# Altium project Multi_Interface_Hub_Pro_v1.0.PrjPcb (part 2 of 3)

## Sheet TypeA_3.1_Ports.SchDoc
size A3; SheetNumber: 1; SheetTotal: 4
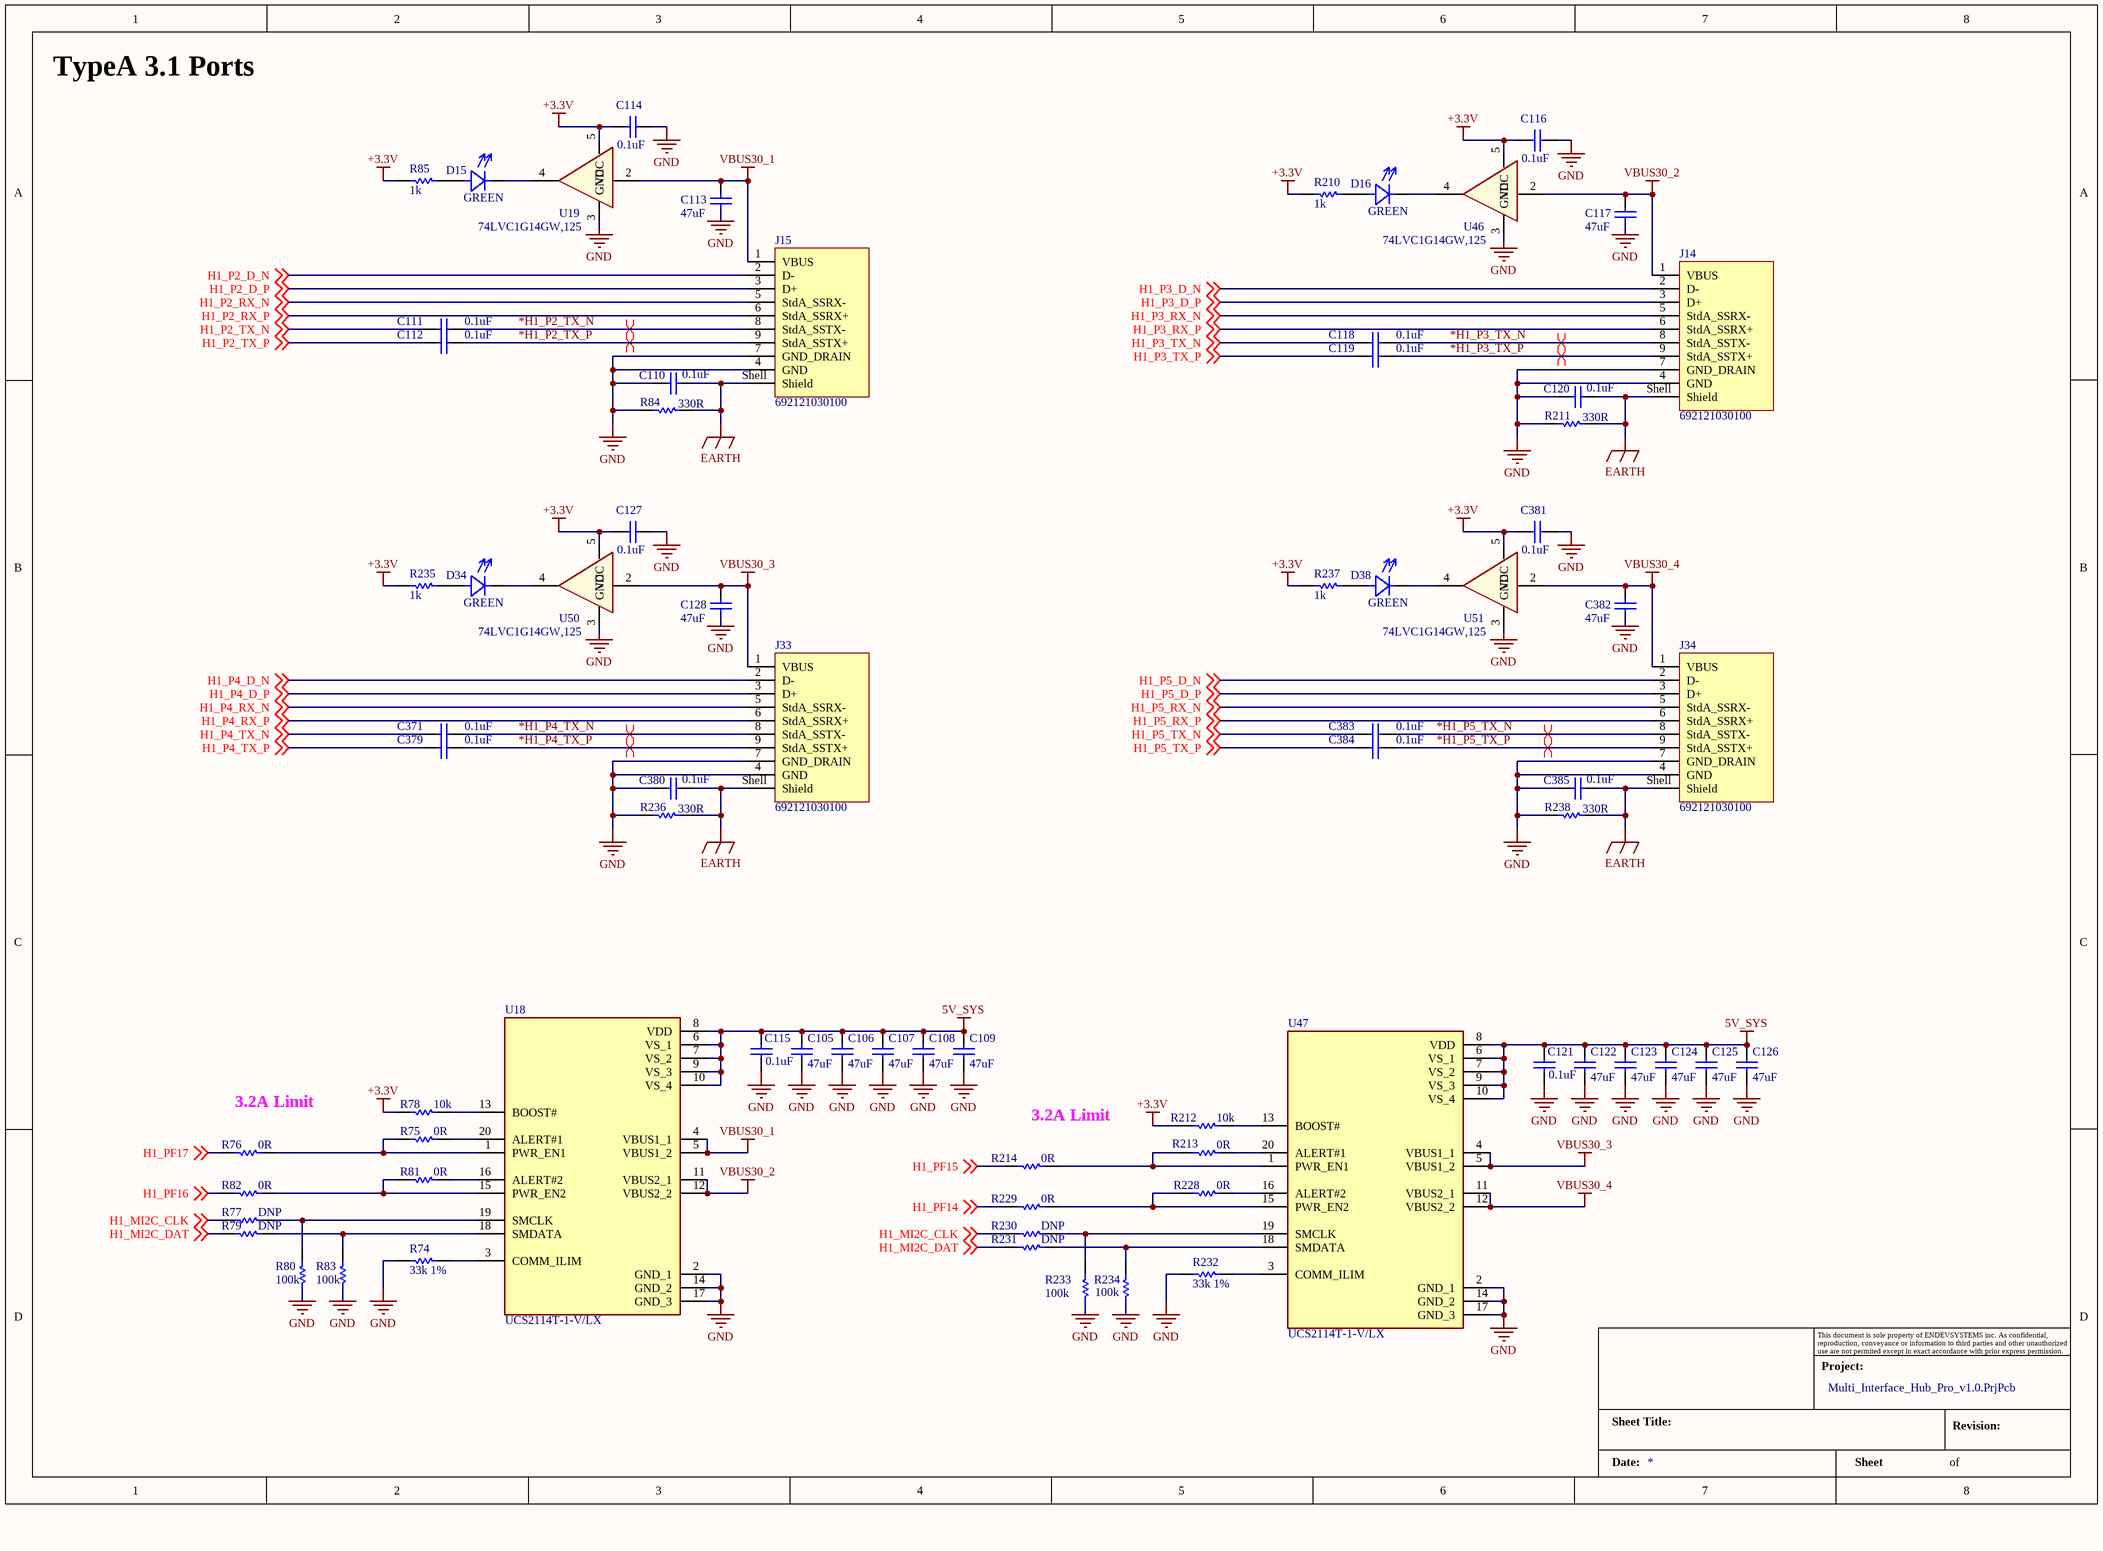
[diagram p5: TypeA_3.1_Ports.SchDoc]

### Parts
(Parts that share a designator on the sheet are numbered #1, #2 ... from top to bottom, then left to right.)
?#6  Project:: Multi_Interface_Hub_Pro_v1.0.PrjPcb  (hidden comment: Title_Block)  (graphical)
C105  value 47uF  [C-0402/1005]  (hidden comment: 0.1uF)
C106  value 47uF  [C-0402/1005]  (hidden comment: 0.1uF)
C107  value 47uF  [C-0402/1005]  (hidden comment: 0.1uF)
C108  value 47uF  [C-0402/1005]  (hidden comment: 0.1uF)
C109  value 47uF  [C-0402/1005]  (hidden comment: 0.1uF)
C110  0.1uF  [C-0603/1608]
C111  0.1uF  [C-0402/1005]
C112  0.1uF  [C-0402/1005]
C113  47uF  [C-0805/2012]
C114  0.1uF  [C-0402/1005]
C115  0.1uF  [C-0402/1005]
C116  0.1uF  [C-0402/1005]
C117  47uF  [C-0805/2012]
C118  0.1uF  [C-0402/1005]
C119  0.1uF  [C-0402/1005]
C120  0.1uF  [C-0603/1608]
C121  0.1uF  [C-0402/1005]
C122  value 47uF  [C-0402/1005]  (hidden comment: 0.1uF)
C123  value 47uF  [C-0402/1005]  (hidden comment: 0.1uF)
C124  value 47uF  [C-0402/1005]  (hidden comment: 0.1uF)
C125  value 47uF  [C-0402/1005]  (hidden comment: 0.1uF)
C126  value 47uF  [C-0402/1005]  (hidden comment: 0.1uF)
C127  0.1uF  [C-0402/1005]
C128  47uF  [C-0805/2012]
C371  0.1uF  [C-0402/1005]
C379  0.1uF  [C-0402/1005]
C380  0.1uF  [C-0603/1608]
C381  0.1uF  [C-0402/1005]
C382  47uF  [C-0805/2012]
C383  0.1uF  [C-0402/1005]
C384  0.1uF  [C-0402/1005]
C385  0.1uF  [C-0603/1608]
D15  GREEN  [LEDC1608X65N]
D16  GREEN  [LEDC1608X65N]
D34  GREEN  [LEDC1608X65N]
D38  GREEN  [LEDC1608X65N]
J14  692121030100  [692121030100]
J15  692121030100  [692121030100]
J33  692121030100  [692121030100]
J34  692121030100  [692121030100]
R74  33k 1%  [R-0402/1005]
R75  0R  [R-0402/1005]
R76  0R  [R-0402/1005]
R77  DNP  [R-0402/1005]
R78  10k  [R-0402/1005]
R79  DNP  [R-0402/1005]
R80  100k  [R-0402/1005]
R81  0R  [R-0402/1005]
R82  0R  [R-0402/1005]
R83  100k  [R-0402/1005]
R84  330R  [R-0603/1608]
R85  1k  [R-0402/1005]
R210  1k  [R-0402/1005]
R211  330R  [R-0603/1608]
R212  10k  [R-0402/1005]
R213  0R  [R-0402/1005]
R214  0R  [R-0402/1005]
R228  0R  [R-0402/1005]
R229  0R  [R-0402/1005]
R230  DNP  [R-0402/1005]
R231  DNP  [R-0402/1005]
R232  33k 1%  [R-0402/1005]
R233  100k  [R-0402/1005]
R234  100k  [R-0402/1005]
R235  1k  [R-0402/1005]
R236  330R  [R-0603/1608]
R237  1k  [R-0402/1005]
R238  330R  [R-0603/1608]
U18  UCS2114T-1-V/LX  [QFN50P300X300X90-20N-D]
U19  74LVC1G14GW,125  [SOT65P212X110-5N]
U46  74LVC1G14GW,125  [SOT65P212X110-5N]
U47  UCS2114T-1-V/LX  [QFN50P300X300X90-20N-D]
U50  74LVC1G14GW,125  [SOT65P212X110-5N]
U51  74LVC1G14GW,125  [SOT65P212X110-5N]

### Nets
5V_SYS: C105.2 C106.2 C107.2 C108.2 C109.2 C115.2 C121.2 C122.2 C123.2 C124.2 C125.2 C126.2 U18.6(VS_1) U18.7(VS_2) U18.8(VDD) U18.9(VS_3) U18.10(VS_4) U47.6(VS_1) U47.7(VS_2) U47.8(VDD) U47.9(VS_3) U47.10(VS_4)
+3.3V: C114.2 C116.2 C127.2 C381.2 R78.1 R85.2 R210.2 R212.1 R235.2 R237.2 U19.5(VCC) U46.5(VCC) U50.5(VCC) U51.5(VCC)
EARTH: C110.1 C120.1 C380.1 C385.1 J14.Shell(Shield) J15.Shell(Shield) J33.Shell(Shield) J34.Shell(Shield) R84.1 R211.1 R236.1 R238.1
GND: C105.1 C106.1 C107.1 C108.1 C109.1 C110.2 C113.1 C114.1 C115.1 C116.1 C117.1 C120.2 C121.1 C122.1 C123.1 C124.1 C125.1 C126.1 C127.1 C128.1 C380.2 C381.1 C382.1 C385.2 J14.4(GND) J14.7(GND_DRAIN) J15.4(GND) J15.7(GND_DRAIN) J33.4(GND) J33.7(GND_DRAIN) J34.4(GND) J34.7(GND_DRAIN) R74.1 R80.1 R83.1 R84.2 R211.2 R232.1 R233.1 R234.1 R236.2 R238.2 U18.2(GND_1) U18.14(GND_2) U18.17(GND_3) U19.3(GND) U46.3(GND) U47.2(GND_1) U47.14(GND_2) U47.17(GND_3) U50.3(GND) U51.3(GND)
VBUS30_1: C113.2 J15.1(VBUS) U18.4(VBUS1_1) U18.5(VBUS1_2) U19.2(A)
VBUS30_2: C117.2 J14.1(VBUS) U18.11(VBUS2_1) U18.12(VBUS2_2) U46.2(A)
VBUS30_3: C128.2 J33.1(VBUS) U47.4(VBUS1_1) U47.5(VBUS1_2) U50.2(A)
VBUS30_4: C382.2 J34.1(VBUS) U47.11(VBUS2_1) U47.12(VBUS2_2) U51.2(A)
*H1_P2_TX_N: C111.1 J15.8(StdA_SSTX-)
*H1_P2_TX_P: C112.1 J15.9(StdA_SSTX+)
*H1_P3_TX_N: C118.1 J14.8(StdA_SSTX-)
*H1_P3_TX_P: C119.1 J14.9(StdA_SSTX+)
*H1_P4_TX_N: C371.1 J33.8(StdA_SSTX-)
*H1_P4_TX_P: C379.1 J33.9(StdA_SSTX+)
*H1_P5_TX_N: C383.1 J34.8(StdA_SSTX-)
*H1_P5_TX_P: C384.1 J34.9(StdA_SSTX+)
H1_MI2C_CLK: R77.1 R230.1 ; off-sheet H1_MI2C_CLK
H1_MI2C_DAT: R79.1 R231.1 ; off-sheet H1_MI2C_DAT
H1_P2_D_N: J15.2(D-) ; off-sheet H1_P2_D_N
H1_P2_D_P: J15.3(D+) ; off-sheet H1_P2_D_P
H1_P2_RX_N: J15.5(StdA_SSRX-) ; off-sheet H1_P2_RX_N
H1_P2_RX_P: J15.6(StdA_SSRX+) ; off-sheet H1_P2_RX_P
H1_P2_TX_N: C111.2 ; off-sheet H1_P2_TX_N
H1_P2_TX_P: C112.2 ; off-sheet H1_P2_TX_P
H1_P3_D_N: J14.2(D-) ; off-sheet H1_P3_D_N
H1_P3_D_P: J14.3(D+) ; off-sheet H1_P3_D_P
H1_P3_RX_N: J14.5(StdA_SSRX-) ; off-sheet H1_P3_RX_N
H1_P3_RX_P: J14.6(StdA_SSRX+) ; off-sheet H1_P3_RX_P
H1_P3_TX_N: C118.2 ; off-sheet H1_P3_TX_N
H1_P3_TX_P: C119.2 ; off-sheet H1_P3_TX_P
H1_P4_D_N: J33.2(D-) ; off-sheet H1_P4_D_N
H1_P4_D_P: J33.3(D+) ; off-sheet H1_P4_D_P
H1_P4_RX_N: J33.5(StdA_SSRX-) ; off-sheet H1_P4_RX_N
H1_P4_RX_P: J33.6(StdA_SSRX+) ; off-sheet H1_P4_RX_P
H1_P4_TX_N: C371.2 ; off-sheet H1_P4_TX_N
H1_P4_TX_P: C379.2 ; off-sheet H1_P4_TX_P
H1_P5_D_N: J34.2(D-) ; off-sheet H1_P5_D_N
H1_P5_D_P: J34.3(D+) ; off-sheet H1_P5_D_P
H1_P5_RX_N: J34.5(StdA_SSRX-) ; off-sheet H1_P5_RX_N
H1_P5_RX_P: J34.6(StdA_SSRX+) ; off-sheet H1_P5_RX_P
H1_P5_TX_N: C383.2 ; off-sheet H1_P5_TX_N
H1_P5_TX_P: C384.2 ; off-sheet H1_P5_TX_P
H1_PF14: R229.1 ; off-sheet H1_PF14
H1_PF15: R214.1 ; off-sheet H1_PF15
H1_PF16: R82.1 ; off-sheet H1_PF16
H1_PF17: R76.1 ; off-sheet H1_PF17
NetD15_A: D15.A R85.1
NetD15_C: D15.C U19.4(~{Y})
NetD16_A: D16.A R210.1
NetD16_C: D16.C U46.4(~{Y})
NetD34_A: D34.A R235.1
NetD34_C: D34.C U50.4(~{Y})
NetD38_A: D38.A R237.1
NetD38_C: D38.C U51.4(~{Y})
NetR74_2: R74.2 U18.3(COMM_ILIM)
NetR75_1: R75.1 R76.2 U18.1(PWR_EN1)
NetR75_2: R75.2 U18.20(ALERT#1)
NetR77_2: R77.2 R80.2 U18.19(SMCLK)
NetR78_2: R78.2 U18.13(BOOST#)
NetR79_2: R79.2 R83.2 U18.18(SMDATA)
NetR81_1: R81.1 R82.2 U18.15(PWR_EN2)
NetR81_2: R81.2 U18.16(ALERT#2)
NetR212_2: R212.2 U47.13(BOOST#)
NetR213_1: R213.1 R214.2 U47.1(PWR_EN1)
NetR213_2: R213.2 U47.20(ALERT#1)
NetR228_1: R228.1 R229.2 U47.15(PWR_EN2)
NetR228_2: R228.2 U47.16(ALERT#2)
NetR230_2: R230.2 R233.2 U47.19(SMCLK)
NetR231_2: R231.2 R234.2 U47.18(SMDATA)
NetR232_2: R232.2 U47.3(COMM_ILIM)

### Layout directives
differential pair; differential pair class Diff_90R: *H1_P2_TX_N, *H1_P2_TX_P, *H1_P3_TX_N, *H1_P3_TX_P, *H1_P4_TX_N, *H1_P4_TX_P, *H1_P5_TX_N, *H1_P5_TX_P

### Notes on the sheet
- TypeA 3.1 Ports
- (near R76) 3.2A Limit
- (near R214) 3.2A Limit
- (in symbol Title_Block) This document is sole property of ENDEVSYSTEMS inc. As confidential, reproduction, conveyance or information to third parties and other unauthorized use are not permited except in exact accordance with prior express permission.; Project:; Sheet Title:; Revision:; Date:; Sheet; of

### Library data of the parts
C105-C112 C114-C116 C118-C127 C371 C379-C381 C383-C385 = Cap: Capacitor; Published: 8-Jun-2000; LatestRevisionDate: 17-Jul-2002; LatestRevisionNote: Re-released for DXP Platform.; PackageReference: RAD-0.3; Publisher: Altium Limited; PackageDescription: Radial Cap, Thru-Hole; 2 Leads; 0.3 in Pin Spacing
  C110-C112 C114-C116 C118-C121 C127 C371 C379-C381 C383-C385: Value: 0.1uF
C113 C117 C128 C382 = Cap: Capacitor; Value: 0.1uF; Published: 8-Jun-2000; LatestRevisionDate: 17-Jul-2002; LatestRevisionNote: Re-released for DXP Platform.; PackageReference: RAD-0.3; Publisher: Altium Limited; PackageDescription: Radial Cap, Thru-Hole; 2 Leads; 0.3 in Pin Spacing
D15 D16 D34 D38 = Diode-LED: Supplier: Digikey Electronics
J14 J15 J33 J34 = CMP-1502-03216-3: NexarPartId: 19667814; Voltage Rating: 30V; Current Rating: 1.8A; Contact Resistance: 50mΩ; Number of Ports: 1; Connector Type: USB; Gender: Receptacle; USB Standard: USB 3.0; Insulation Resistance: 100MΩ; Number of Contacts: 9; RoHS: Compliant; Voltage Rating (AC): 30V; Min Operating Temperature: -20°C; Contact Material: Bronze, Gold, Nickel; Features: Shielded; Color: Blue; Termination: Through Hole; Mount: Horizontal, Through Hole; Length: 15.48mm; Max Operating Temperature: 85°C; Packaging: Tape and Reel; Flammability Rating: UL94 V-0; Lead Free: Lead Free; REACH SVHC: Unknown; Number of Pins: 9; Contact Plating: Gold; Width: 16.48mm; Height: 7.87mm; Operating Supply Voltage: 30V; Orientation: Horizontal
R74-R77 R79-R85 R210 R211 R213 R214 R228-R238 = Res1: Resistor; Value: 10K; Published: 8-Jun-2000; LatestRevisionDate: 17-Jul-2002; LatestRevisionNote: Re-released for DXP Platform.; PackageReference: AXIAL-0.3; Publisher: Altium Limited; PackageDescription: Axial Device, Thru-Hole; 2 Leads; 0.3 in Pin Spacing
R78 R212 = Res1: Resistor; Published: 8-Jun-2000; LatestRevisionDate: 17-Jul-2002; LatestRevisionNote: Re-released for DXP Platform.; PackageReference: AXIAL-0.3; Publisher: Altium Limited; PackageDescription: Axial Device, Thru-Hole; 2 Leads; 0.3 in Pin Spacing; Value: 10K
U18 U47 = UCS2114T-1-V_LX: Integrated Circuit; Manufacturer_Name: Microchip; Datasheet Link: https://www.mouser.in/datasheet/2/268/UCS2114_Data_Sheet_20005743B-2900672.pdf; Height: 0.9mm; Manufacturer_Part_Number: UCS2114T-1-V/LX; Mouser Part Number: 579-UCS2114T-1-V/LX; Mouser Price/Stock: https://www.mouser.co.uk/ProductDetail/Microchip-Technology/UCS2114T-1-V-LX?qs=Mv7BduZupUg9QQFwmxWMcA%3D%3D; Arrow Part Number: UCS2114T-1-V/LX; Arrow Price/Stock: https://www.arrow.com/en/products/ucs2114t-1-vlx/microchip-technology?region=nac
U19 U46 U50 U51 = 74LVC1G14GW,125: Inverter Schmitt Trigger 1-Element CMOS 5-Pin TSSOP T/R; Price: None; Availability: Unavailable; MP: 74LVC1G14GW,125; Value: *; Package: None
?#6 = Title_Block: Date:: *

## Sheet USBC_DS1_DS2.SchDoc
size A3; SheetNumber: 1; SheetTotal: 4; SPICEModelCacheQHYZYIJX: <root> / <DocumentId>QHYZYIJX</DocumentId> / </root>
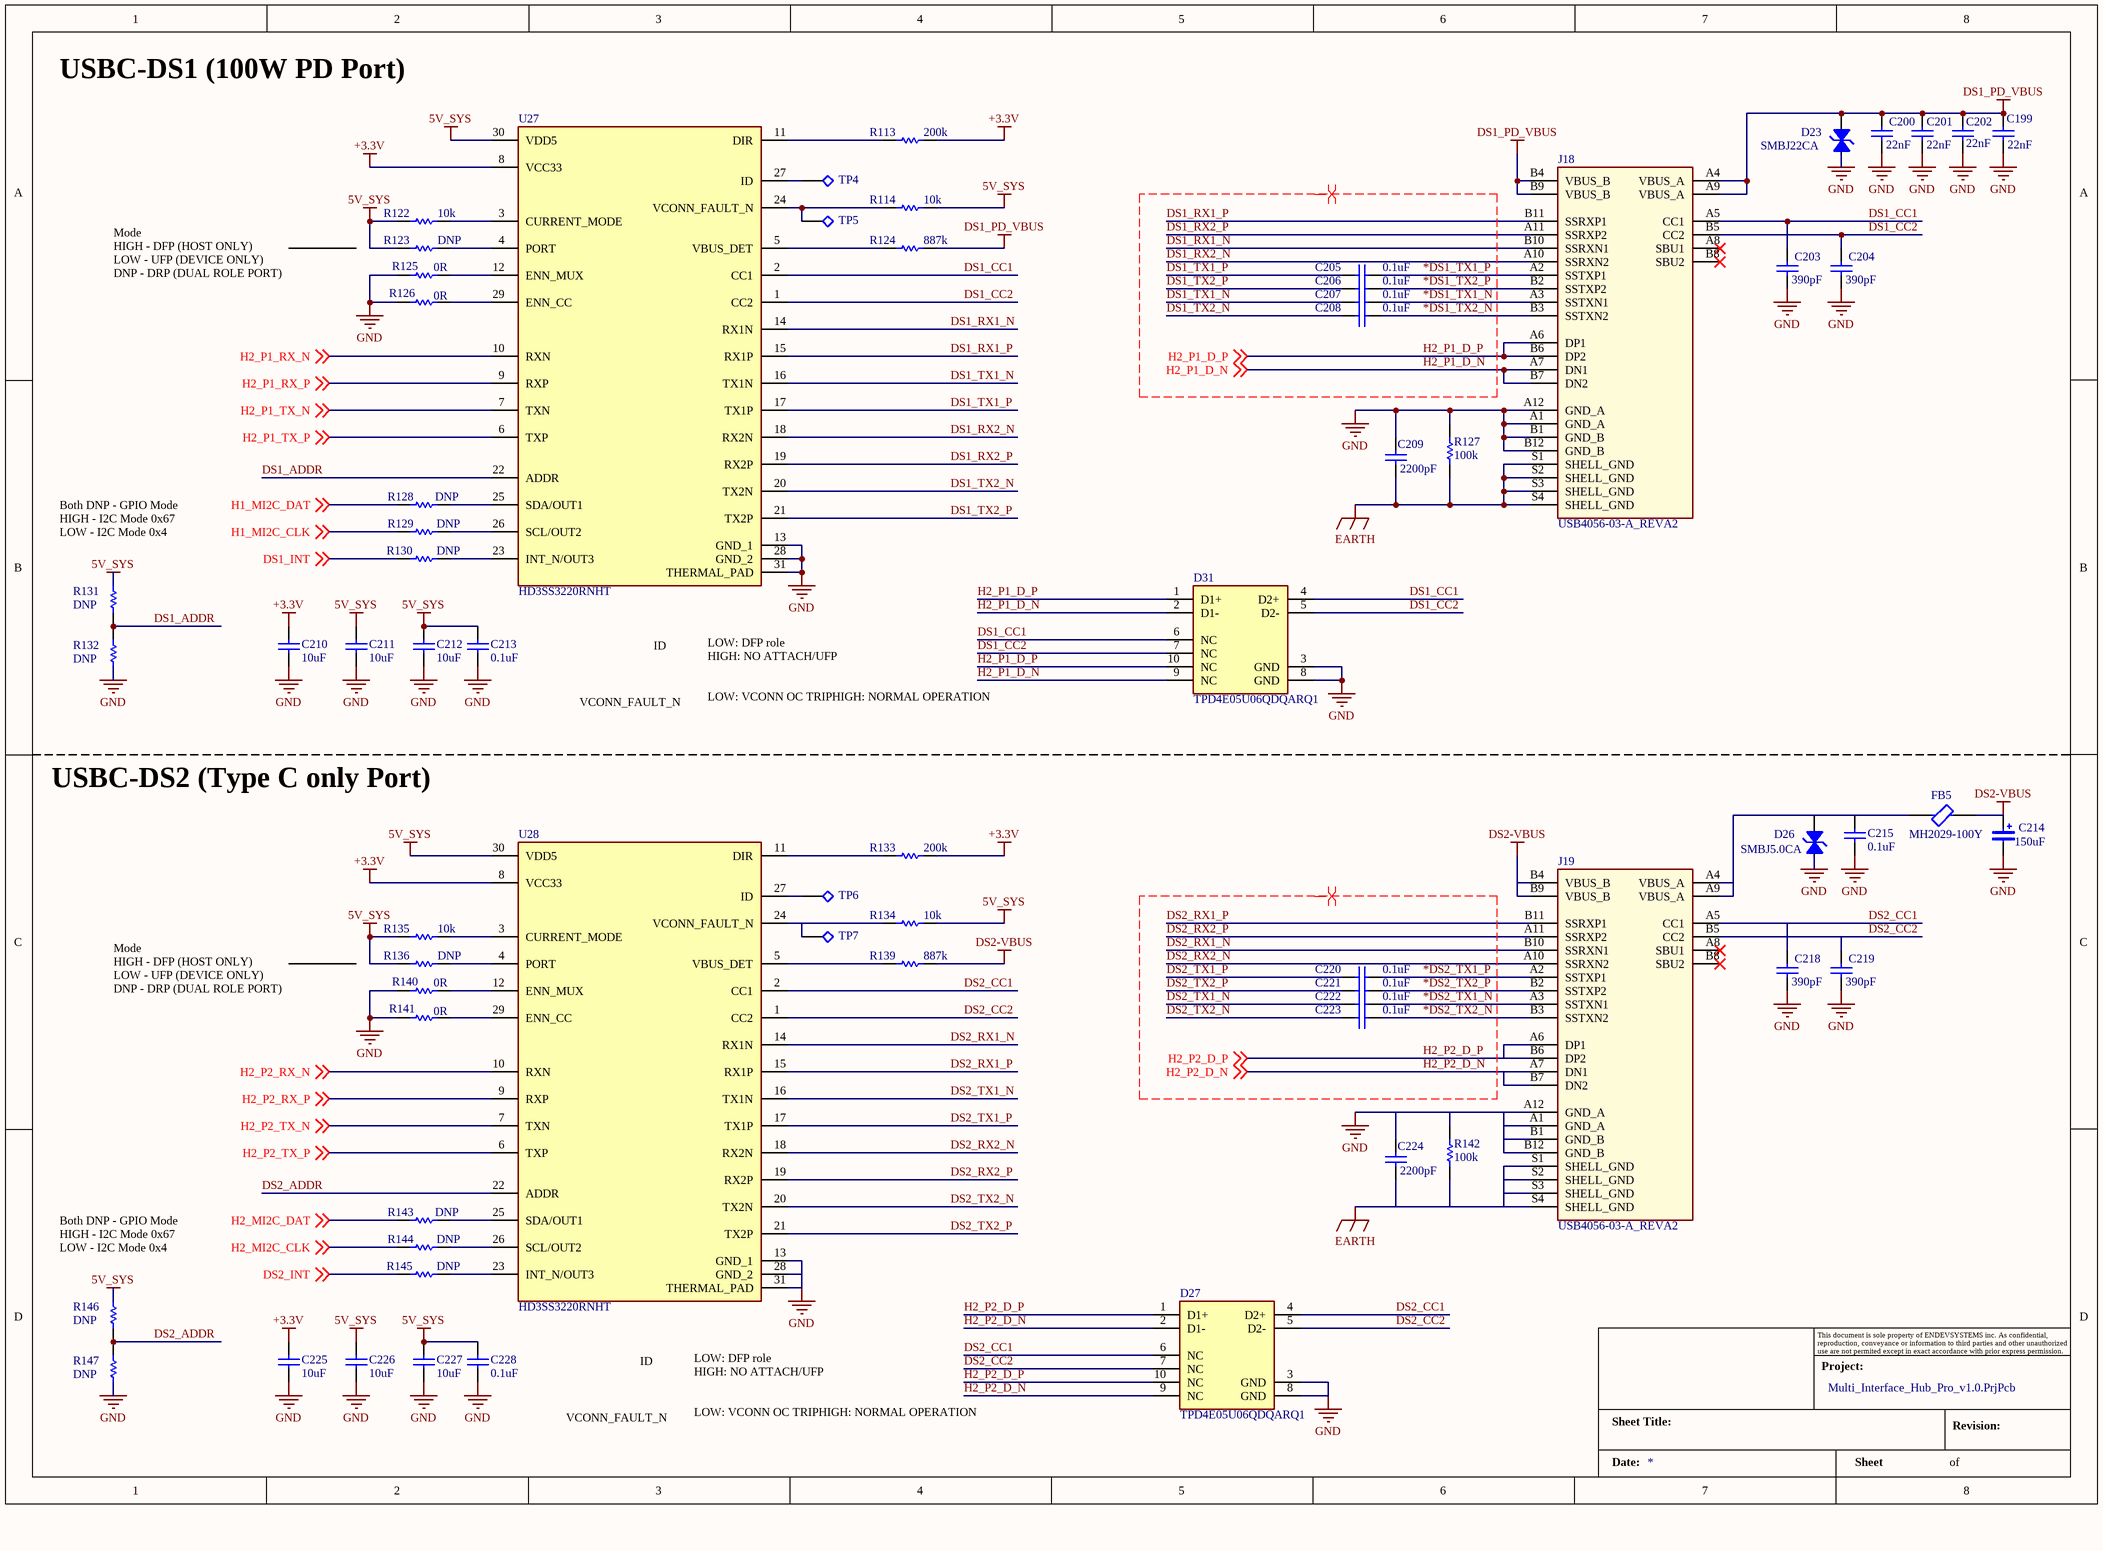
[diagram p6: USBC_DS1_DS2.SchDoc]

### Parts
(Parts that share a designator on the sheet are numbered #1, #2 ... from top to bottom, then left to right.)
?#7  Project:: Multi_Interface_Hub_Pro_v1.0.PrjPcb  (hidden comment: Title_Block)  (graphical)
C199  22nF  [C-0805/2012]
C200  22nF  [C-0805/2012]
C201  22nF  [C-0805/2012]
C202  22nF  [C-0805/2012]
C203  390pF  [C-0805/2012]
C204  390pF  [C-0805/2012]
C205  0.1uF  [CAP 1206/3216]
C206  0.1uF  [CAP 1206/3216]
C207  0.1uF  [CAP 1206/3216]
C208  0.1uF  [CAP 1206/3216]
C209  2200pF  [C-0603/1608]
C210  10uF  [CAP 1206/3216]
C211  10uF  [CAP 1206/3216]
C212  10uF  [CAP 1206/3216]
C213  0.1uF  [CAP 1206/3216]
C214  150uF  [CAP-TAN-2312]
C215  0.1uF  [CAP 1206/3216]
C218  390pF  [C-0805/2012]
C219  390pF  [C-0805/2012]
C220  0.1uF  [CAP 1206/3216]
C221  0.1uF  [CAP 1206/3216]
C222  0.1uF  [CAP 1206/3216]
C223  0.1uF  [CAP 1206/3216]
C224  2200pF  [C-0603/1608]
C225  10uF  [CAP 1206/3216]
C226  10uF  [CAP 1206/3216]
C227  10uF  [CAP 1206/3216]
C228  0.1uF  [CAP 1206/3216]
D23  SMBJ22CA  [DO-214AA\SMB]
D26  SMBJ5.0CA  [DO-214AA\SMB]
D27  TPD4E05U06QDQARQ1  [FP-DQA0010A-MFG]
D31  TPD4E05U06QDQARQ1  [FP-DQA0010A-MFG]
FB5  MH2029-100Y  [R-0805/2012]
J18  USB4056-03-A_REVA2  [GCT_USB4056-03-A_REVA2]
J19  USB4056-03-A_REVA2  [GCT_USB4056-03-A_REVA2]
R113  200k  [R-0402]
R114  10k  [R-0402]
R122  10k  [R-0402]
R123  DNP  [R-0402]
R124  887k  [R-0402]
R125  0R  [R-0402]
R126  0R  [R-0402]
R127  100k  [R-0603/1608]
R128  DNP  [R-0402]
R129  DNP  [R-0402]
R130  DNP  [R-0402]
R131  DNP  [R-0402]
R132  DNP  [R-0402]
R133  200k  [R-0402]
R134  10k  [R-0402]
R135  10k  [R-0402]
R136  DNP  [R-0402]
R139  887k  [R-0402]
R140  0R  [R-0402]
R141  0R  [R-0402]
R142  100k  [R-0603/1608]
R143  DNP  [R-0402]
R144  DNP  [R-0402]
R145  DNP  [R-0402]
R146  DNP  [R-0402]
R147  DNP  [R-0402]
TP4  Test Points  [Test Point TH Round H0.9,D1.6]  (value not drawn)
TP5  Test Points  [Test Point TH Round H0.9,D1.6]  (value not drawn)
TP6  Test Points  [Test Point TH Round H0.9,D1.6]  (value not drawn)
TP7  Test Points  [Test Point TH Round H0.9,D1.6]  (value not drawn)
U27  HD3SS3220RNHT  [QFN40P250X450X80-31N-D]
U28  HD3SS3220RNHT  [QFN40P250X450X80-31N-D]

### Nets
5V_SYS: C211.2 C212.2 C213.2 C226.2 C227.2 C228.2 R114.2 R122.1 R123.1 R131.2 R134.2 R135.1 R136.1 R146.2 U27.30(VDD5) U28.30(VDD5)
+3.3V: C210.2 C225.2 R113.2 R133.2 U27.8(VCC33) U28.8(VCC33)
DS1_PD_VBUS: C199.2 C200.2 C201.2 C202.2 D23.2 J18.A4(VBUS_A) J18.A9(VBUS_A) J18.B4(VBUS_B) J18.B9(VBUS_B) R124.1
DS2-VBUS: C214.+ FB5.2 J19.B4(VBUS_B) J19.B9(VBUS_B) R139.1
EARTH: C209.1 C224.1 J18.S1(SHELL_GND) J18.S2(SHELL_GND) J18.S3(SHELL_GND) J18.S4(SHELL_GND) J19.S1(SHELL_GND) J19.S2(SHELL_GND) J19.S3(SHELL_GND) J19.S4(SHELL_GND) R127.1 R142.1
GND: C199.1 C200.1 C201.1 C202.1 C203.1 C204.1 C209.2 C210.2 C211.2 C212.2 C213.2 C214.- C215.2 C218.1 C219.1 C224.2 C225.2 C226.2 C227.2 C228.2 D23.1 D26.1 D27.3(GND) D27.8(GND) D31.3(GND) D31.8(GND) J18.A1(GND_A) J18.A12(GND_A) J18.B1(GND_B) J18.B12(GND_B) J19.A1(GND_A) J19.A12(GND_A) J19.B1(GND_B) J19.B12(GND_B) R125.1 R126.1 R127.2 R132.1 R140.1 R141.1 R142.2 R147.1 U27.13(GND_1) U27.28(GND_2) U27.31(THERMAL_PAD) U28.13(GND_1) U28.28(GND_2) U28.31(THERMAL_PAD)
*DS1_TX1_N: C207.2 J18.A3(SSTXN1)
*DS1_TX1_P: C205.2 J18.A2(SSTXP1)
*DS1_TX2_N: C208.2 J18.B3(SSTXN2)
*DS1_TX2_P: C206.2 J18.B2(SSTXP2)
*DS2_TX1_N: C222.2 J19.A3(SSTXN1)
*DS2_TX1_P: C220.2 J19.A2(SSTXP1)
*DS2_TX2_N: C223.2 J19.B3(SSTXN2)
*DS2_TX2_P: C221.2 J19.B2(SSTXP2)
DS1_ADDR: R131.1 R132.2 U27.22(ADDR)
DS1_CC1: C203.2 D31.4(D2+) D31.6(NC) J18.A5(CC1) U27.2(CC1)
DS1_CC2: C204.2 D31.5(D2-) D31.7(NC) J18.B5(CC2) U27.1(CC2)
DS1_INT: R130.1 ; off-sheet DS1_INT
DS1_RX1_N: J18.B10(SSRXN1) U27.14(RX1N)
DS1_RX1_P: J18.B11(SSRXP1) U27.15(RX1P)
DS1_RX2_N: J18.A10(SSRXN2) U27.18(RX2N)
DS1_RX2_P: J18.A11(SSRXP2) U27.19(RX2P)
DS1_TX1_N: C207.2 U27.16(TX1N)
DS1_TX1_P: C205.2 U27.17(TX1P)
DS1_TX2_N: C208.2 U27.20(TX2N)
DS1_TX2_P: C206.2 U27.21(TX2P)
DS2_ADDR: R146.1 R147.2 U28.22(ADDR)
DS2_CC1: C218.2 D27.4(D2+) D27.6(NC) J19.A5(CC1) U28.2(CC1)
DS2_CC2: C219.2 D27.5(D2-) D27.7(NC) J19.B5(CC2) U28.1(CC2)
DS2_INT: R145.1 ; off-sheet DS2_INT
DS2_RX1_N: J19.B10(SSRXN1) U28.14(RX1N)
DS2_RX1_P: J19.B11(SSRXP1) U28.15(RX1P)
DS2_RX2_N: J19.A10(SSRXN2) U28.18(RX2N)
DS2_RX2_P: J19.A11(SSRXP2) U28.19(RX2P)
DS2_TX1_N: C222.2 U28.16(TX1N)
DS2_TX1_P: C220.2 U28.17(TX1P)
DS2_TX2_N: C223.2 U28.20(TX2N)
DS2_TX2_P: C221.2 U28.21(TX2P)
H1_MI2C_CLK: R129.1 ; off-sheet H1_MI2C_CLK
H1_MI2C_DAT: R128.1 ; off-sheet H1_MI2C_DAT
H2_MI2C_CLK: R144.1 ; off-sheet H2_MI2C_CLK
H2_MI2C_DAT: R143.1 ; off-sheet H2_MI2C_DAT
H2_P1_D_N: D31.2(D1-) D31.9(NC) J18.A7(DN1) J18.B7(DN2) ; off-sheet H2_P1_D_N
H2_P1_D_P: D31.1(D1+) D31.10(NC) J18.A6(DP1) J18.B6(DP2) ; off-sheet H2_P1_D_P
H2_P1_RX_N: U27.10(RXN) ; off-sheet H2_P1_RX_N
H2_P1_RX_P: U27.9(RXP) ; off-sheet H2_P1_RX_P
H2_P1_TX_N: U27.7(TXN) ; off-sheet H2_P1_TX_N
H2_P1_TX_P: U27.6(TXP) ; off-sheet H2_P1_TX_P
H2_P2_D_N: D27.2(D1-) D27.9(NC) J19.A7(DN1) J19.B7(DN2) ; off-sheet H2_P2_D_N
H2_P2_D_P: D27.1(D1+) D27.10(NC) J19.A6(DP1) J19.B6(DP2) ; off-sheet H2_P2_D_P
H2_P2_RX_N: U28.10(RXN) ; off-sheet H2_P2_RX_N
H2_P2_RX_P: U28.9(RXP) ; off-sheet H2_P2_RX_P
H2_P2_TX_N: U28.7(TXN) ; off-sheet H2_P2_TX_N
H2_P2_TX_P: U28.6(TXP) ; off-sheet H2_P2_TX_P
NetC215_2: C215.2 D26.2 FB5.1 J19.A4(VBUS_A) J19.A9(VBUS_A)
NetR113_1: R113.1 U27.11(DIR)
NetR114_1: R114.1 TP5.1 U27.24(VCONN_FAULT_N)
NetR122_2: R122.2 U27.3(CURRENT_MODE)
NetR123_2: R123.2 U27.4(PORT)
NetR124_2: R124.2 U27.5(VBUS_DET)
NetR125_2: R125.2 U27.12(ENN_MUX)
NetR126_2: R126.2 U27.29(ENN_CC)
NetR128_2: R128.2 U27.25(SDA/OUT1)
NetR129_2: R129.2 U27.26(SCL/OUT2)
NetR130_2: R130.2 U27.23(INT_N/OUT3)
NetR133_1: R133.1 U28.11(DIR)
NetR134_1: R134.1 TP7.1 U28.24(VCONN_FAULT_N)
NetR135_2: R135.2 U28.3(CURRENT_MODE)
NetR136_2: R136.2 U28.4(PORT)
NetR139_2: R139.2 U28.5(VBUS_DET)
NetR140_2: R140.2 U28.12(ENN_MUX)
NetR141_2: R141.2 U28.29(ENN_CC)
NetR143_2: R143.2 U28.25(SDA/OUT1)
NetR144_2: R144.2 U28.26(SCL/OUT2)
NetR145_2: R145.2 U28.23(INT_N/OUT3)
NetTP4_1: TP4.1 U27.27(ID)
NetTP6_1: TP6.1 U28.27(ID)

Not connected (* = marked no-connect by the designer): J18 A8(SBU1)* B8(SBU2)*; J19 A8(SBU1)* B8(SBU2)*

### Layout directives
differential pair; differential pair class Diff_90R: *DS1_TX1_N, *DS1_TX1_P, *DS1_TX2_N, *DS1_TX2_P, *DS2_TX1_N, *DS2_TX1_P, *DS2_TX2_N, *DS2_TX2_P, DS1_RX1_N, DS1_RX1_P, DS1_RX2_N, DS1_RX2_P, DS1_TX1_N, DS1_TX1_P, DS1_TX2_N, DS1_TX2_P, DS2_RX1_N, DS2_RX1_P, DS2_RX2_N, DS2_RX2_P, DS2_TX1_N, DS2_TX1_P, DS2_TX2_N, DS2_TX2_P, H2_P1_D_N, H2_P1_D_P, H2_P2_D_N, H2_P2_D_P

### Notes on the sheet
- USBC-DS1 (100W PD Port)
- Mode
  HIGH - DFP (HOST ONLY)
  LOW - UFP (DEVICE ONLY)
  DNP - DRP (DUAL ROLE PORT)
- (near R131) Both DNP - GPIO Mode
  HIGH - I2C Mode 0x67
  LOW - I2C Mode 0x4
- ID
- VCONN_FAULT_N
- LOW: DFP role
  HIGH: NO ATTACH/UFP
- LOW: VCONN OC TRIPHIGH: NORMAL OPERATION
- USBC-DS2 (Type C only Port)
- (near R146) Both DNP - GPIO Mode
  HIGH - I2C Mode 0x67
  LOW - I2C Mode 0x4
- (in symbol Title_Block) This document is sole property of ENDEVSYSTEMS inc. As confidential, reproduction, conveyance or information to third parties and other unauthorized use are not permited except in exact accordance with prior express permission.; Project:; Sheet Title:; Revision:; Date:; Sheet; of

### Library data of the parts
C199-C204 C209 C218 C219 C224 = Cap: Capacitor; Value: 0.1uF; Published: 8-Jun-2000; LatestRevisionDate: 17-Jul-2002; LatestRevisionNote: Re-released for DXP Platform.; PackageReference: RAD-0.3; Publisher: Altium Limited; PackageDescription: Radial Cap, Thru-Hole; 2 Leads; 0.3 in Pin Spacing
C205-C208 C210-C213 C215 C220-C223 C225-C228 = CAP 1206/3216: CAP CER 10UF 25V X5R 1206; Mfr. Part No.: C1206C106M3PACTU; Unit Price (USD): 0.28; Supplier Part No.: 399-8153-1-ND; Supplier: Digikey Electronics
C214 = Capacitor-Polar: CAP TANT 10UF 10% 16V 1206; Mfr. Part No.: F931C106KAAAJ6; Unit Price (USD): 0.67; Value: 10uF 16V; Supplier Part No.: 478-10723-1-ND; Supplier: Digikey Electronics
D23 D26 = ACPDQC3V3T-HF: TVS DIODE 3.3V 9.8V 0402C; Unit Price (USD): 0.41; Mfr. Part No.: ACPDQC3V3T-HF; Supplier Part No.: 641-1635-1-ND; Supplier: Digikey Electronics
D27 D31 = CMP-04985-000004-1: TVS DIODE 5.5V 14V 10USON; Manufacturer: Texas Instruments; Direction: Unidirectional; Standoff Height: 0mm; Description: 14V Clamp 2.5A (8/20µs) Ipp Tvs Diode Surface Mount 10-USON (2.5x1); Capacitance: 0.5pF; Number Of Channels: 4; Breakdown Voltage: 6.4V; Peak Pulse Power: 2.5W; Automotive Grade: Grade 1; Value: 0.5pF; Interface: USB,Ethernet,LVDS,Other; Peak Pulse Current: 2.5A; Operating Supply Voltage: 5.5V; Reverse Standoff Voltage: 5.5V; Package: DQA0010A; Temperature Range Low: -40°C; Temperature Range High: +125°C; Ambient Temperature Range Low: -40°C; Device Class L1: Circuit Protection; Clamping Voltage: 14V; Manufacturer Part Number: TPD4E05U06QDQARQ1; Device Class L2: ESD and Circuit Protection ICs; Octopart: https://octopart.com/tpd4e05u06qdqarq1-texas+instruments-48523459; Device Class L3: unset; Height: 0.55mm; Automotive: Yes; ComponentLink2Description: Datasheet; RoHS: TRUE; Ambient Temperature Range High: +125°C; Category: IC; Mouser Description: Automotive 4-Channel ESD Protection Solution for SuperSpeed (up to 5 Gbps) Interface 10-USON -40 to 125; Temperature: -40°C to +125°C; ComponentLink2URL: http://www.ti.com/lit/ds/symlink/tpd4e05u06-q1.pdf; Digikey Description: TVS DIODE 5.5V 14V 10USON; Lead Free: Yes
FB5 = 5f30dd21d616792df468990f7003faa: Chip Ferrite Bead Array, 1206, 50Ω @ 100MHz, 0.0016Ω, ±12.5Ω, 12A; Number of Lines: 1; DC Resistance (DCR): 1.6mR; Max Current Rating: 12A; Case Code (Metric): 3216; Package Quantity: 3000; Height: 0.051inch; RoHS Compliant: Yes; Case/Package: 1206; Mount: Surface Mount; Case Code (Imperial): 1206; Width: 0.063inch; Length: 0.126inch; Max Operating Temperature: 125°C; Ratings: AEC-Q200; Packaging: Tape and Reel; Min Operating Temperature: -55°C
J18 J19 = USB4056-03-A_REVA2: USB-C (USB TYPE-C) USB 3.2 Gen 2 (USB 3.1 Gen 2, Superspeed + (USB 3.1)) Receptacle Connector 24 Position Surface Mount, Right Angle; Through Hole; MF: Global Connector Technology; Package: None; Check_prices: https://www.snapeda.com/parts/USB4056-03-A/Global+Connector+Technology/view-part/?ref=eda; Value: *; Availability: In Stock; SnapEDA_Link: https://www.snapeda.com/parts/USB4056-03-A/Global+Connector+Technology/view-part/?ref=snap; MP: USB4056-03-A; Price: None
R113 R114 R122-R126 R128-R136 R139-R141 R143-R147 = Resistor: RES SMD 51 OHM 0.5% 1/16W 0402; Mfr. Part No.: ERA-2AED510X; Value: 51R; Unit Price (USD): 0.21; Supplier Part No.: P51DECT-ND; Supplier: Digikey Electronics
R127 R142 = Res1: Resistor; Value: 10K; Published: 8-Jun-2000; LatestRevisionDate: 17-Jul-2002; LatestRevisionNote: Re-released for DXP Platform.; PackageReference: AXIAL-0.3; Publisher: Altium Limited; PackageDescription: Axial Device, Thru-Hole; 2 Leads; 0.3 in Pin Spacing
U27 U28 = HD3SS3220RNHT: Integrated Circuit; Manufacturer_Name: Texas Instruments; Datasheet Link: http://www.ti.com/lit/gpn/HD3SS3220; Height: 0.8mm; Manufacturer_Part_Number: HD3SS3220RNHT; Mouser Part Number: 595-HD3SS3220RNHT; Mouser Price/Stock: https://www.mouser.co.uk/ProductDetail/Texas-Instruments/HD3SS3220RNHT?qs=8%2FmU9qzJpL9k3fo1z5Ctsg%3D%3D; Arrow Part Number: HD3SS3220RNHT; Arrow Price/Stock: https://www.arrow.com/en/products/hd3ss3220rnht/texas-instruments?region=nac
?#7 = Title_Block: Date:: *

## Sheet USBC_DS3_DS4.SchDoc
size A3; SheetNumber: 1; SheetTotal: 4
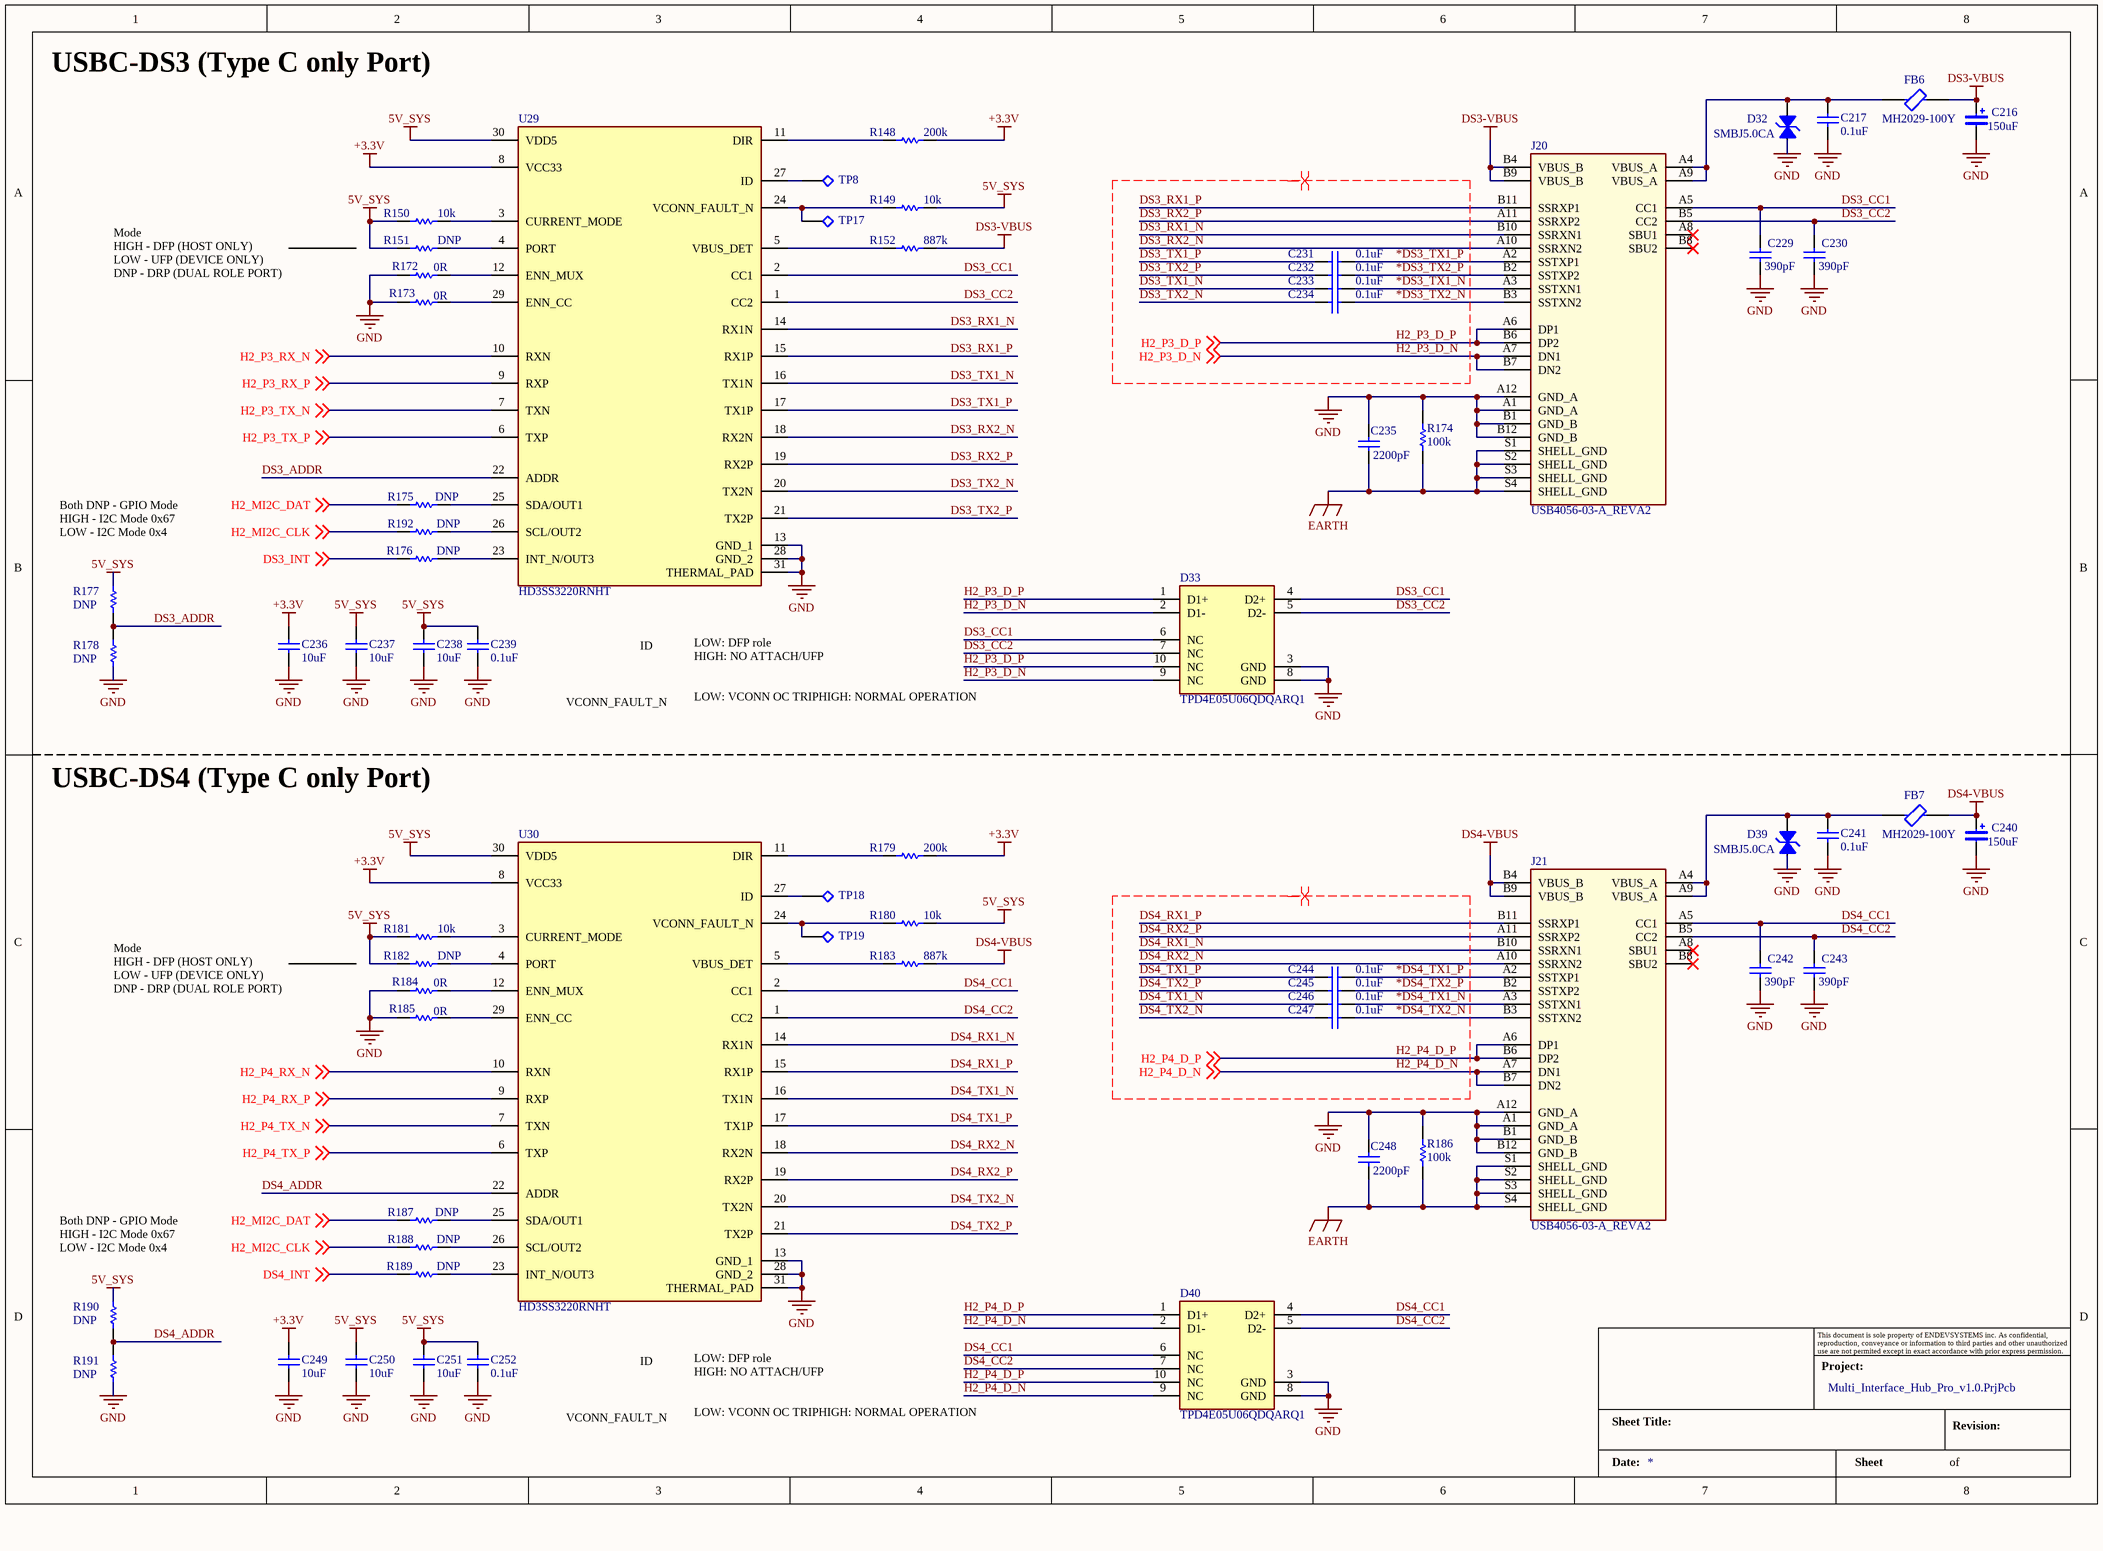
[diagram p7: USBC_DS3_DS4.SchDoc]

### Parts
(Parts that share a designator on the sheet are numbered #1, #2 ... from top to bottom, then left to right.)
?#8  Project:: Multi_Interface_Hub_Pro_v1.0.PrjPcb  (hidden comment: Title_Block)  (graphical)
C216  150uF  [CAP-TAN-2312]
C217  0.1uF  [CAP 1206/3216]
C229  390pF  [C-0805/2012]
C230  390pF  [C-0805/2012]
C231  0.1uF  [CAP 1206/3216]
C232  0.1uF  [CAP 1206/3216]
C233  0.1uF  [CAP 1206/3216]
C234  0.1uF  [CAP 1206/3216]
C235  2200pF  [C-0603/1608]
C236  10uF  [CAP 1206/3216]
C237  10uF  [CAP 1206/3216]
C238  10uF  [CAP 1206/3216]
C239  0.1uF  [CAP 1206/3216]
C240  150uF  [CAP-TAN-2312]
C241  0.1uF  [CAP 1206/3216]
C242  390pF  [C-0805/2012]
C243  390pF  [C-0805/2012]
C244  0.1uF  [CAP 1206/3216]
C245  0.1uF  [CAP 1206/3216]
C246  0.1uF  [CAP 1206/3216]
C247  0.1uF  [CAP 1206/3216]
C248  2200pF  [C-0603/1608]
C249  10uF  [CAP 1206/3216]
C250  10uF  [CAP 1206/3216]
C251  10uF  [CAP 1206/3216]
C252  0.1uF  [CAP 1206/3216]
D32  SMBJ5.0CA  [DO-214AA\SMB]
D33  TPD4E05U06QDQARQ1  [FP-DQA0010A-MFG]
D39  SMBJ5.0CA  [DO-214AA\SMB]
D40  TPD4E05U06QDQARQ1  [FP-DQA0010A-MFG]
FB6  MH2029-100Y  [R-0805/2012]
FB7  MH2029-100Y  [R-0805/2012]
J20  USB4056-03-A_REVA2  [GCT_USB4056-03-A_REVA2]
J21  USB4056-03-A_REVA2  [GCT_USB4056-03-A_REVA2]
R148  200k  [R-0402]
R149  10k  [R-0402]
R150  10k  [R-0402]
R151  DNP  [R-0402]
R152  887k  [R-0402]
R172  0R  [R-0402]
R173  0R  [R-0402]
R174  100k  [R-0603/1608]
R175  DNP  [R-0402]
R176  DNP  [R-0402]
R177  DNP  [R-0402]
R178  DNP  [R-0402]
R179  200k  [R-0402]
R180  10k  [R-0402]
R181  10k  [R-0402]
R182  DNP  [R-0402]
R183  887k  [R-0402]
R184  0R  [R-0402]
R185  0R  [R-0402]
R186  100k  [R-0603/1608]
R187  DNP  [R-0402]
R188  DNP  [R-0402]
R189  DNP  [R-0402]
R190  DNP  [R-0402]
R191  DNP  [R-0402]
R192  DNP  [R-0402]
TP8  Test Points  [Test Point TH Round H0.9,D1.6]  (value not drawn)
TP17  Test Points  [Test Point TH Round H0.9,D1.6]  (value not drawn)
TP18  Test Points  [Test Point TH Round H0.9,D1.6]  (value not drawn)
TP19  Test Points  [Test Point TH Round H0.9,D1.6]  (value not drawn)
U29  HD3SS3220RNHT  [QFN40P250X450X80-31N-D]
U30  HD3SS3220RNHT  [QFN40P250X450X80-31N-D]

### Nets
5V_SYS: C237.2 C238.2 C239.2 C250.2 C251.2 C252.2 R149.2 R150.1 R151.1 R177.2 R180.2 R181.1 R182.1 R190.2 U29.30(VDD5) U30.30(VDD5)
+3.3V: C236.2 C249.2 R148.2 R179.2 U29.8(VCC33) U30.8(VCC33)
DS3-VBUS: C216.+ FB6.2 J20.B4(VBUS_B) J20.B9(VBUS_B) R152.1
DS4-VBUS: C240.+ FB7.2 J21.B4(VBUS_B) J21.B9(VBUS_B) R183.1
EARTH: C235.1 C248.1 J20.S1(SHELL_GND) J20.S2(SHELL_GND) J20.S3(SHELL_GND) J20.S4(SHELL_GND) J21.S1(SHELL_GND) J21.S2(SHELL_GND) J21.S3(SHELL_GND) J21.S4(SHELL_GND) R174.1 R186.1
GND: C216.- C217.2 C229.1 C230.1 C235.2 C236.2 C237.2 C238.2 C239.2 C240.- C241.2 C242.1 C243.1 C248.2 C249.2 C250.2 C251.2 C252.2 D32.1 D33.3(GND) D33.8(GND) D39.1 D40.3(GND) D40.8(GND) J20.A1(GND_A) J20.A12(GND_A) J20.B1(GND_B) J20.B12(GND_B) J21.A1(GND_A) J21.A12(GND_A) J21.B1(GND_B) J21.B12(GND_B) R172.1 R173.1 R174.2 R178.1 R184.1 R185.1 R186.2 R191.1 U29.13(GND_1) U29.28(GND_2) U29.31(THERMAL_PAD) U30.13(GND_1) U30.28(GND_2) U30.31(THERMAL_PAD)
*DS3_TX1_N: C233.2 J20.A3(SSTXN1)
*DS3_TX1_P: C231.2 J20.A2(SSTXP1)
*DS3_TX2_N: C234.2 J20.B3(SSTXN2)
*DS3_TX2_P: C232.2 J20.B2(SSTXP2)
*DS4_TX1_N: C246.2 J21.A3(SSTXN1)
*DS4_TX1_P: C244.2 J21.A2(SSTXP1)
*DS4_TX2_N: C247.2 J21.B3(SSTXN2)
*DS4_TX2_P: C245.2 J21.B2(SSTXP2)
DS3_ADDR: R177.1 R178.2 U29.22(ADDR)
DS3_CC1: C229.2 D33.4(D2+) D33.6(NC) J20.A5(CC1) U29.2(CC1)
DS3_CC2: C230.2 D33.5(D2-) D33.7(NC) J20.B5(CC2) U29.1(CC2)
DS3_INT: R176.1 ; off-sheet DS3_INT
DS3_RX1_N: J20.B10(SSRXN1) U29.14(RX1N)
DS3_RX1_P: J20.B11(SSRXP1) U29.15(RX1P)
DS3_RX2_N: J20.A10(SSRXN2) U29.18(RX2N)
DS3_RX2_P: J20.A11(SSRXP2) U29.19(RX2P)
DS3_TX1_N: C233.2 U29.16(TX1N)
DS3_TX1_P: C231.2 U29.17(TX1P)
DS3_TX2_N: C234.2 U29.20(TX2N)
DS3_TX2_P: C232.2 U29.21(TX2P)
DS4_ADDR: R190.1 R191.2 U30.22(ADDR)
DS4_CC1: C242.2 D40.4(D2+) D40.6(NC) J21.A5(CC1) U30.2(CC1)
DS4_CC2: C243.2 D40.5(D2-) D40.7(NC) J21.B5(CC2) U30.1(CC2)
DS4_INT: R189.1 ; off-sheet DS4_INT
DS4_RX1_N: J21.B10(SSRXN1) U30.14(RX1N)
DS4_RX1_P: J21.B11(SSRXP1) U30.15(RX1P)
DS4_RX2_N: J21.A10(SSRXN2) U30.18(RX2N)
DS4_RX2_P: J21.A11(SSRXP2) U30.19(RX2P)
DS4_TX1_N: C246.2 U30.16(TX1N)
DS4_TX1_P: C244.2 U30.17(TX1P)
DS4_TX2_N: C247.2 U30.20(TX2N)
DS4_TX2_P: C245.2 U30.21(TX2P)
H2_MI2C_CLK: R188.1 R192.1 ; off-sheet H2_MI2C_CLK
H2_MI2C_DAT: R175.1 R187.1 ; off-sheet H2_MI2C_DAT
H2_P3_D_N: D33.2(D1-) D33.9(NC) J20.A7(DN1) J20.B7(DN2) ; off-sheet H2_P3_D_N
H2_P3_D_P: D33.1(D1+) D33.10(NC) J20.A6(DP1) J20.B6(DP2) ; off-sheet H2_P3_D_P
H2_P3_RX_N: U29.10(RXN) ; off-sheet H2_P3_RX_N
H2_P3_RX_P: U29.9(RXP) ; off-sheet H2_P3_RX_P
H2_P3_TX_N: U29.7(TXN) ; off-sheet H2_P3_TX_N
H2_P3_TX_P: U29.6(TXP) ; off-sheet H2_P3_TX_P
H2_P4_D_N: D40.2(D1-) D40.9(NC) J21.A7(DN1) J21.B7(DN2) ; off-sheet H2_P4_D_N
H2_P4_D_P: D40.1(D1+) D40.10(NC) J21.A6(DP1) J21.B6(DP2) ; off-sheet H2_P4_D_P
H2_P4_RX_N: U30.10(RXN) ; off-sheet H2_P4_RX_N
H2_P4_RX_P: U30.9(RXP) ; off-sheet H2_P4_RX_P
H2_P4_TX_N: U30.7(TXN) ; off-sheet H2_P4_TX_N
H2_P4_TX_P: U30.6(TXP) ; off-sheet H2_P4_TX_P
NetC217_2: C217.2 D32.2 FB6.1 J20.A4(VBUS_A) J20.A9(VBUS_A)
NetC241_2: C241.2 D39.2 FB7.1 J21.A4(VBUS_A) J21.A9(VBUS_A)
NetR148_1: R148.1 U29.11(DIR)
NetR149_1: R149.1 TP17.1 U29.24(VCONN_FAULT_N)
NetR150_2: R150.2 U29.3(CURRENT_MODE)
NetR151_2: R151.2 U29.4(PORT)
NetR152_2: R152.2 U29.5(VBUS_DET)
NetR172_2: R172.2 U29.12(ENN_MUX)
NetR173_2: R173.2 U29.29(ENN_CC)
NetR175_2: R175.2 U29.25(SDA/OUT1)
NetR176_2: R176.2 U29.23(INT_N/OUT3)
NetR179_1: R179.1 U30.11(DIR)
NetR180_1: R180.1 TP19.1 U30.24(VCONN_FAULT_N)
NetR181_2: R181.2 U30.3(CURRENT_MODE)
NetR182_2: R182.2 U30.4(PORT)
NetR183_2: R183.2 U30.5(VBUS_DET)
NetR184_2: R184.2 U30.12(ENN_MUX)
NetR185_2: R185.2 U30.29(ENN_CC)
NetR187_2: R187.2 U30.25(SDA/OUT1)
NetR188_2: R188.2 U30.26(SCL/OUT2)
NetR189_2: R189.2 U30.23(INT_N/OUT3)
NetR192_2: R192.2 U29.26(SCL/OUT2)
NetTP8_1: TP8.1 U29.27(ID)
NetTP18_1: TP18.1 U30.27(ID)

Not connected (* = marked no-connect by the designer): J20 A8(SBU1)* B8(SBU2)*; J21 A8(SBU1)* B8(SBU2)*

### Layout directives
differential pair; differential pair class Diff_90R: *DS3_TX1_N, *DS3_TX1_P, *DS3_TX2_N, *DS3_TX2_P, *DS4_TX1_N, *DS4_TX1_P, *DS4_TX2_N, *DS4_TX2_P, DS3_RX1_N, DS3_RX1_P, DS3_RX2_N, DS3_RX2_P, DS3_TX1_N, DS3_TX1_P, DS3_TX2_N, DS3_TX2_P, DS4_RX1_N, DS4_RX1_P, DS4_RX2_N, DS4_RX2_P, DS4_TX1_N, DS4_TX1_P, DS4_TX2_N, DS4_TX2_P, H2_P3_D_N, H2_P3_D_P, H2_P4_D_N, H2_P4_D_P

### Notes on the sheet
- USBC-DS3 (Type C only Port)
- Mode
  HIGH - DFP (HOST ONLY)
  LOW - UFP (DEVICE ONLY)
  DNP - DRP (DUAL ROLE PORT)
- (near R177) Both DNP - GPIO Mode
  HIGH - I2C Mode 0x67
  LOW - I2C Mode 0x4
- ID
- VCONN_FAULT_N
- LOW: DFP role
  HIGH: NO ATTACH/UFP
- LOW: VCONN OC TRIPHIGH: NORMAL OPERATION
- USBC-DS4 (Type C only Port)
- (near R190) Both DNP - GPIO Mode
  HIGH - I2C Mode 0x67
  LOW - I2C Mode 0x4
- (in symbol Title_Block) This document is sole property of ENDEVSYSTEMS inc. As confidential, reproduction, conveyance or information to third parties and other unauthorized use are not permited except in exact accordance with prior express permission.; Project:; Sheet Title:; Revision:; Date:; Sheet; of

### Library data of the parts
C216 C240 = Capacitor-Polar: as C214 on sheet USBC_DS1_DS2; Supplier Part No.: 478-10723-1-ND; Supplier: Digikey Electronics
C217 C231-C234 C236-C239 C241 C244-C247 C249-C252 = CAP 1206/3216: as C205 on sheet USBC_DS1_DS2; Supplier Part No.: 399-8153-1-ND; Supplier: Digikey Electronics
C229 C230 C235 C242 C243 C248 = Cap: Capacitor; Value: 0.1uF; Published: 8-Jun-2000; LatestRevisionDate: 17-Jul-2002; LatestRevisionNote: Re-released for DXP Platform.; PackageReference: RAD-0.3; Publisher: Altium Limited; PackageDescription: Radial Cap, Thru-Hole; 2 Leads; 0.3 in Pin Spacing
D32 D39 = ACPDQC3V3T-HF: as D23 on sheet USBC_DS1_DS2; Mfr. Part No.: ACPDQC3V3T-HF; Supplier Part No.: 641-1635-1-ND; Supplier: Digikey Electronics
D33 D40 = CMP-04985-000004-1: as D27 on sheet USBC_DS1_DS2; Operating Supply Voltage: 5.5V; Reverse Standoff Voltage: 5.5V; Package: DQA0010A; Temperature Range Low: -40°C; Temperature Range High: +125°C; Ambient Temperature Range Low: -40°C; Device Class L1: Circuit Protection; Clamping Voltage: 14V; Manufacturer Part Number: TPD4E05U06QDQARQ1; Device Class L2: ESD and Circuit Protection ICs; Octopart: https://octopart.com/tpd4e05u06qdqarq1-texas+instruments-48523459; Device Class L3: unset; Height: 0.55mm; Automotive: Yes; ComponentLink2Description: Datasheet; RoHS: TRUE; Ambient Temperature Range High: +125°C; Category: IC; Mouser Description: Automotive 4-Channel ESD Protection Solution for SuperSpeed (up to 5 Gbps) Interface 10-USON -40 to 125; Temperature: -40°C to +125°C; ComponentLink2URL: http://www.ti.com/lit/ds/symlink/tpd4e05u06-q1.pdf; Digikey Description: TVS DIODE 5.5V 14V 10USON; Lead Free: Yes
FB6 FB7 = 5f30dd21d616792df468990f7003faa: as FB5 on sheet USBC_DS1_DS2; Max Current Rating: 12A; Case Code (Metric): 3216; Package Quantity: 3000; Height: 0.051inch; RoHS Compliant: Yes; Case/Package: 1206; Mount: Surface Mount; Case Code (Imperial): 1206; Width: 0.063inch; Length: 0.126inch; Max Operating Temperature: 125°C; Ratings: AEC-Q200; Packaging: Tape and Reel; Min Operating Temperature: -55°C
J20 J21 = USB4056-03-A_REVA2: as J18 on sheet USBC_DS1_DS2; Package: None; Check_prices: https://www.snapeda.com/parts/USB4056-03-A/Global+Connector+Technology/view-part/?ref=eda; Value: *; Availability: In Stock; SnapEDA_Link: https://www.snapeda.com/parts/USB4056-03-A/Global+Connector+Technology/view-part/?ref=snap; MP: USB4056-03-A; Price: None
R148-R152 R172 R173 R175-R185 R187-R192 = Resistor: as R113 on sheet USBC_DS1_DS2; Supplier Part No.: P51DECT-ND; Supplier: Digikey Electronics
R174 R186 = Res1: Resistor; Value: 10K; Published: 8-Jun-2000; LatestRevisionDate: 17-Jul-2002; LatestRevisionNote: Re-released for DXP Platform.; PackageReference: AXIAL-0.3; Publisher: Altium Limited; PackageDescription: Axial Device, Thru-Hole; 2 Leads; 0.3 in Pin Spacing
U29 U30 = HD3SS3220RNHT: as U27 on sheet USBC_DS1_DS2; Datasheet Link: http://www.ti.com/lit/gpn/HD3SS3220; Height: 0.8mm; Manufacturer_Part_Number: HD3SS3220RNHT; Mouser Part Number: 595-HD3SS3220RNHT; Mouser Price/Stock: https://www.mouser.co.uk/ProductDetail/Texas-Instruments/HD3SS3220RNHT?qs=8%2FmU9qzJpL9k3fo1z5Ctsg%3D%3D; Arrow Part Number: HD3SS3220RNHT; Arrow Price/Stock: https://www.arrow.com/en/products/hd3ss3220rnht/texas-instruments?region=nac
?#8 = Title_Block: Date:: *

## Sheet USBC-DS1-100W-PD.SchDoc
size A3; SheetNumber: 1; SheetTotal: 4; SPICEModelCacheUZKMSWNJ: <root> / <DocumentId>UZKMSWNJ</DocumentId> / </root>
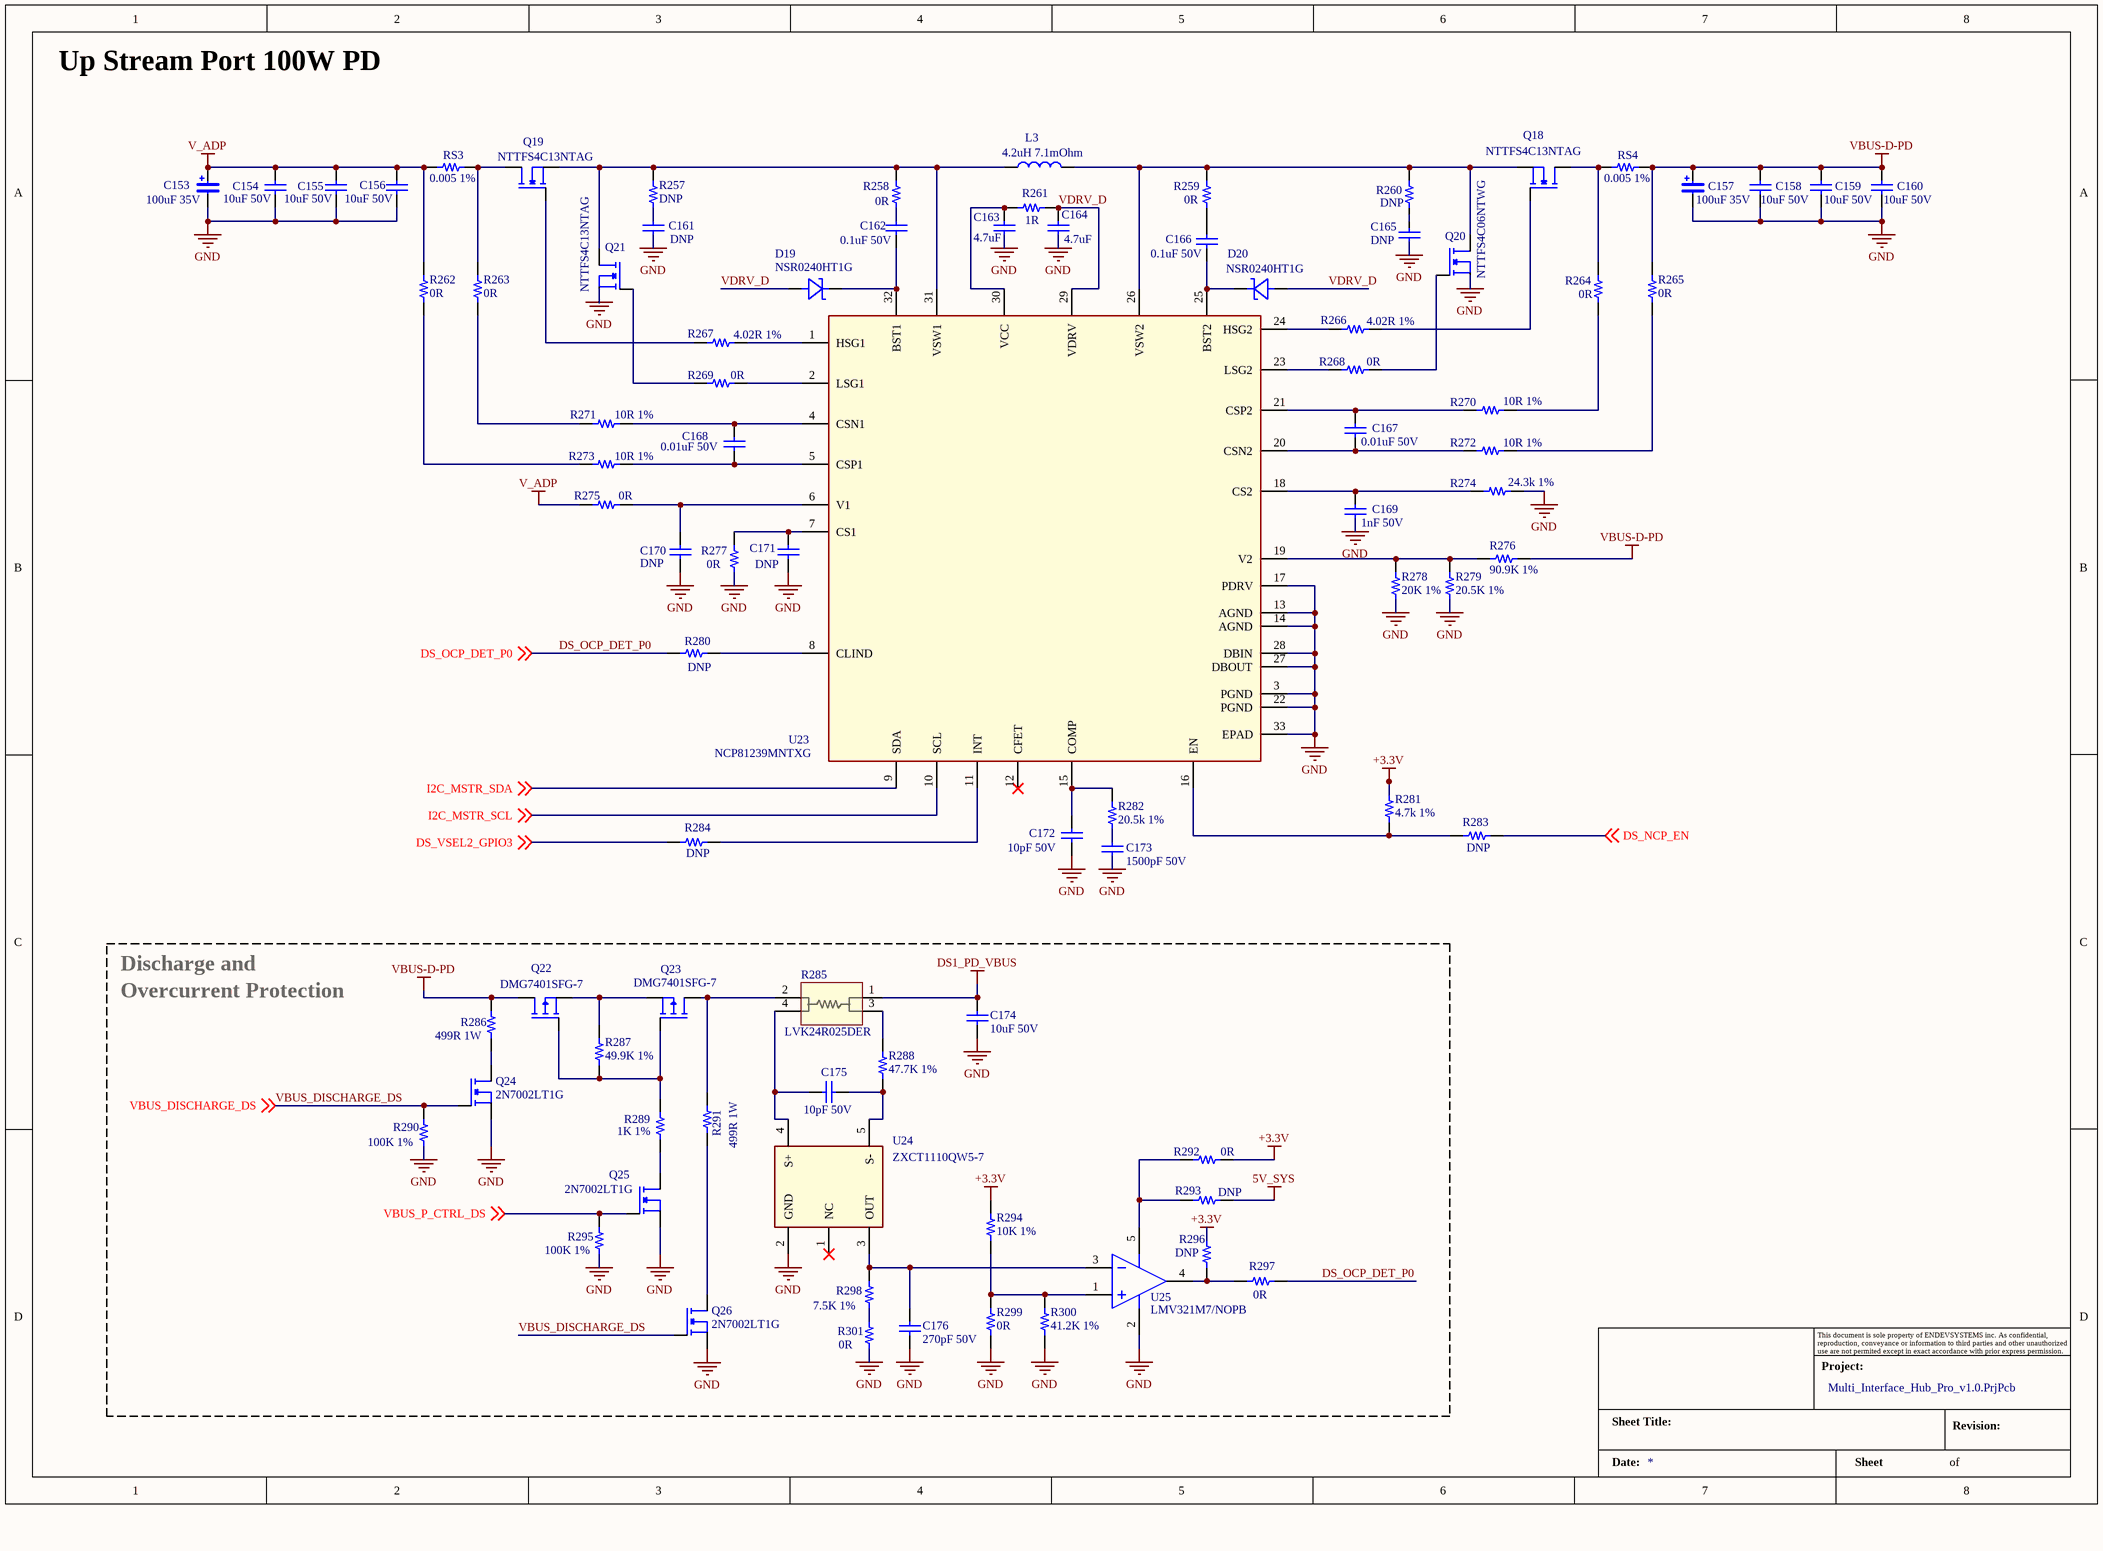
[diagram p8: USBC-DS1-100W-PD.SchDoc]

### Parts
(Parts that share a designator on the sheet are numbered #1, #2 ... from top to bottom, then left to right.)
?#9  Project:: Multi_Interface_Hub_Pro_v1.0.PrjPcb  (hidden comment: Title_Block)  (graphical)
C153  100uF 35V  [C-1206 (Tantalum)]
C154  10uF 50V  [C-0402/1005]
C155  10uF 50V  [C-0402/1005]
C156  10uF 50V  [C-0402/1005]
C157  100uF 35V  [C-1206 (Tantalum)]
C158  10uF 50V  [C-0402/1005]
C159  10uF 50V  [C-0402/1005]
C160  10uF 50V  [C-0402/1005]
C161  DNP  [C-0402/1005]
C162  0.1uF 50V  [C-0402/1005]
C163  4.7uF  [C-0402/1005]
C164  4.7uF  [C-0402/1005]
C165  DNP  [C-0402/1005]
C166  0.1uF 50V  [C-0402/1005]
C167  0.01uF 50V  [C-0402/1005]
C168  0.01uF 50V  [C-0402/1005]
C169  1nF 50V  [C-0402/1005]
C170  DNP  [C-0402/1005]
C171  DNP  [C-0402/1005]
C172  10pF 50V  [C-0402/1005]
C173  1500pF 50V  [C-0402/1005]
C174  value 10uF 50V  [C-0402/1005]  (hidden comment: 0.1uF)
C175  value 10pF 50V  [C-0402/1005]  (hidden comment: 0.1uF)
C176  value 270pF 50V  [C-0402/1005]  (hidden comment: 0.1uF)
D19  NSR0240HT1G  [SOIC-8 (W3.9mm) B]
D20  NSR0240HT1G  [SOIC-8 (W3.9mm) B]
L3  4.2uH 7.1mOhm  [4.3x4.3mm]
Q18  NTTFS4C13NTAG
Q19  NTTFS4C13NTAG
Q20  NTTFS4C06NTWG
Q21  NTTFS4C13NTAG
Q22  DMG7401SFG-7
Q23  DMG7401SFG-7
Q24  2N7002LT1G
Q25  2N7002LT1G
Q26  2N7002LT1G
R257  DNP  [R-0402]
R258  0R  [R-0402]
R259  0R  [R-0402]
R260  DNP  [R-0402]
R261  1R  [R-0402]
R262  0R  [R-0402]
R263  0R  [R-0402]
R264  0R  [R-0402]
R265  0R  [R-0402]
R266  4.02R 1%  [R-0402]
R267  4.02R 1%  [R-0402]
R268  0R  [R-0402]
R269  0R  [R-0402]
R270  10R 1%  [R-0402]
R271  10R 1%  [R-0402]
R272  10R 1%  [R-0402]
R273  10R 1%  [R-0402]
R274  24.3k 1%  [R-0402]
R275  0R  [R-0402]
R276  90.9K 1%  [R-0402]
R277  0R  [R-0402]
R278  20K 1%  [R-0402]
R279  20.5K 1%  [R-0402]
R280  DNP  [R-0402]
R281  4.7k 1%  [R-0402]
R282  20.5k 1%  [R-0402]
R283  DNP  [R-0402]
R284  DNP  [R-0402]
R285  LVK24R025DER  [LVK24_OHM]
R286  499R 1W  [R-0402]
R287  49.9K 1%  [R-0402]
R288  47.7K 1%  [R-0402]
R289  1K 1%  [R-0402]
R290  100K 1%  [R-0402]
R291  499R 1W  [R-0402]
R292  0R  [R-0402]
R293  DNP  [R-0402]
R294  10K 1%  [R-0402]
R295  100K 1%  [R-0402]
R296  DNP  [R-0402]
R297  0R  [R-0402]
R298  7.5K 1%  [R-0402]
R299  0R  [R-0402]
R300  41.2K 1%  [R-0402]
R301  0R  [R-0402]
RS3  0.005 1%  [R-0402]
RS4  0.005 1%  [R-0402]
U23  NCP81239MNTXG  [QFN32_5X5_ONS]
U24  ZXCT1110QW5-7  [MSOP-10-W3mm]
U25  LMV321M7/NOPB  [DCK0005A_M]

### Nets
5V_SYS: R293.1
+3.3V: R281.1 R292.1 R294.2 R296.2
DS1_PD_VBUS: C174.1 R285.1(E1)
GND: C153.- C154.1 C155.1 C156.1 C157.- C158.1 C159.1 C160.1 C161.1 C163.1 C164.1 C165.1 C169.1 C170.1 C171.1 C172.1 C173.1 C174.2 C176.2 Q20.2(S) Q21.2(S) Q24.2(S) Q25.2(S) Q26.2(S) R274.2 R277.2 R278.2 R279.2 R290.1 R295.1 R299.1 R300.1 R301.1 U23.3(PGND) U23.13(AGND) U23.14(AGND) U23.17(PDRV) U23.22(PGND) U23.27(DBOUT) U23.28(DBIN) U23.33(EPAD) U24.2(GND) U25.2(V-)
V_ADP: C153.+ C154.2 C155.2 C156.2 R262.1 R275.2 RS3.1
VBUS-D-PD: C157.+ C158.2 C159.2 C160.2 Q22.3 R265.2 R276.2 R286.2 RS4.2
DS_NCP_EN: R283.2 ; off-sheet DS_NCP_EN
DS_OCP_DET_P0: R280.2 R297.1 ; off-sheet DS_OCP_DET_P0
DS_VSEL2_GPIO3: R284.2 ; off-sheet DS_VSEL2_GPIO3
I2C_MSTR_SCL: U23.10(SCL) ; off-sheet I2C_MSTR_SCL
I2C_MSTR_SDA: U23.9(SDA) ; off-sheet I2C_MSTR_SDA
VBUS_DISCHARGE_DS: Q24.1(G) Q26.1(G) R290.2 ; off-sheet VBUS_DISCHARGE_DS
VBUS_P_CTRL_DS: Q25.1(G) R295.2 ; off-sheet VBUS_P_CTRL_DS
VDRV_D: C164.2 D19.A D20.A R261.1 U23.29(VDRV)
NetC161_2: C161.2 R257.1
NetC162_1: C162.1 D19.C U23.32(BST1)
NetC162_2: C162.2 R258.1
NetC163_2: C163.2 R261.2 U23.30(VCC)
NetC165_2: C165.2 R260.1
NetC166_1: C166.1 D20.C U23.25(BST2)
NetC166_2: C166.2 R259.1
NetC167_1: C167.1 R272.2 U23.20(CSN2)
NetC167_2: C167.2 R270.2 U23.21(CSP2)
NetC168_1: C168.1 R273.1 U23.5(CSP1)
NetC168_2: C168.2 R271.1 U23.4(CSN1)
NetC169_2: C169.2 R274.1 U23.18(CS2)
NetC170_2: C170.2 R275.1 U23.6(V1)
NetC171_2: C171.2 R277.1 U23.7(CS1)
NetC172_2: C172.2 R282.1 U23.15(COMP)
NetC173_2: C173.2 R282.2
NetC175_1: C175.1 R288.1 U24.5(S-)
NetC175_2: C175.2 R285.4 U24.4(S+)
NetC176_1: C176.1 R298.2 U24.3(OUT) U25.3(IN-)
NetL3_1: L3.1 Q19.2(S) Q21.3(D) R257.2 R258.2 U23.31(VSW1)
NetL3_2: L3.2 Q18.2(S) Q20.3(D) R259.2 R260.2 U23.26(VSW2)
NetQ18_1: Q18.1(G) R266.1
NetQ18_3: Q18.3(D) R264.2 RS4.1
NetQ19_1: Q19.1(G) R267.2
NetQ19_3: Q19.3(D) R263.1 RS3.2
NetQ20_1: Q20.1(G) R268.1
NetQ21_1: Q21.1(G) R269.2
NetQ22_1: Q22.1 Q23.1 R287.1 R289.2
NetQ22_2: Q22.2 Q23.2 R287.2
NetQ23_3: Q23.3 R285.2(E2) R291.2
NetQ24_3: Q24.3(D) R286.1
NetQ25_3: Q25.3(D) R289.1
NetQ26_3: Q26.3(D) R291.1
NetR262_2: R262.2 R273.2
NetR263_2: R263.2 R271.2
NetR264_1: R264.1 R270.1
NetR265_1: R265.1 R272.1
NetR266_2: R266.2 U23.24(HSG2)
NetR267_1: R267.1 U23.1(HSG1)
NetR268_2: R268.2 U23.23(LSG2)
NetR269_1: R269.1 U23.2(LSG1)
NetR276_1: R276.1 R278.1 R279.1 U23.19(V2)
NetR280_1: R280.1 U23.8(CLIND)
NetR281_2: R281.2 R283.1 U23.16(EN)
NetR284_1: R284.1 U23.11(INT)
NetR285_3: R285.3 R288.2
NetR292_2: R292.2 R293.2 U25.5(V+)
NetR294_1: R294.1 R299.2 R300.2 U25.1(IN+)
NetR296_1: R296.1 R297.2 U25.4(OUT)
NetR298_1: R298.1 R301.2

Not connected (* = marked no-connect by the designer): U23 12(CFET)*; U24 1(NC)*

### Notes on the sheet
- Up Stream Port 100W PD
- Discharge and
- Overcurrent Protection
- (in symbol Title_Block) This document is sole property of ENDEVSYSTEMS inc. As confidential, reproduction, conveyance or information to third parties and other unauthorized use are not permited except in exact accordance with prior express permission.; Project:; Sheet Title:; Revision:; Date:; Sheet; of

### Library data of the parts
C153 C157 = Capacitor-Polar: as C214 on sheet USBC_DS1_DS2; Supplier Part No.: 478-10723-1-ND; Supplier: Digikey Electronics
C154-C156 C158-C161 C163-C165 C167-C173 = Cap: Capacitor; Value: 0.1uF; Published: 8-Jun-2000; LatestRevisionDate: 17-Jul-2002; LatestRevisionNote: Re-released for DXP Platform.; PackageReference: RAD-0.3; Publisher: Altium Limited; PackageDescription: Radial Cap, Thru-Hole; 2 Leads; 0.3 in Pin Spacing
C162 C166 C174-C176 = Cap: Capacitor; Published: 8-Jun-2000; LatestRevisionDate: 17-Jul-2002; LatestRevisionNote: Re-released for DXP Platform.; PackageReference: RAD-0.3; Publisher: Altium Limited; PackageDescription: Radial Cap, Thru-Hole; 2 Leads; 0.3 in Pin Spacing
  C162 C166: Value: 0.1uF
D19 D20 = Diode-Schottky: Supplier: Digikey Electronics
L3 = 4.3x4.3mm: FIXED IND 22UH 620MA 350 MOHM; Mfr. Part No.: ASPI-4020S-220M-T; Unit Price (USD): 0.48; Supplier Part No.: 535-12307-1-ND; Value: 22uH; Supplier: Digikey Electronics
Q18-Q21 Q24-Q26 = MOSFET-N: Supplier: Digikey Electronics
Q22 Q23 = MOSFET-P: Supplier: Digikey Electronics
R257-R284 R286-R301 RS3 RS4 = Resistor: as R113 on sheet USBC_DS1_DS2; Supplier Part No.: P51DECT-ND; Supplier: Digikey Electronics
R285 = LVK24R025DER: No Description Available; Mfr_Name: Ohmite; RefDes: RefDes; Type: Type
U23 = NCP81239MNTXG: No Description Available; Mfr_Name: onsemi; RefDes: RefDes; Type: Type
U24 = LT8607EMSE#PBF: IC REG BUCK ADJ 750MA 8DFN; Mfr. Part No.: LT8607EDC#TRMPBF; Unit Price (USD): 5.48; Supplier: Digikey Electronics; Supplier Part No.: LT8607EMSE#PBF-ND
U25 = CMP-0055-01046-3: General Purpose, Low Voltage, Rail-to-Rail Output Operational Amplifiers, 5-pin SC-70, Pb-Free; Manufacturer: Texas Instruments; PackageTopMarking: A12*XTT; PowerWise: N; CompType: Amplifiers; ComponentLink1Description: Datasheet URL; Code_JEITA: SC-88A; ComponentLink1URL: http://www.ti.com/general/docs/lit/getliterature.tsp?genericPartNumber=LMV321-N&fileType=pdf; Code_IPC: SOT353-5; PinCount: 5; RoHS: Y; Code_JEDEC: MO-203-AA; PackageDescription: Molded SC-70, 2 x 1.25 x .9mm, 5 Lead, 0.65mm Pitch; Package Reference: DCK0005A
?#9 = Title_Block: Date:: *

## Sheet PowerSwitch_DS2_DS3_DS4.SchDoc
size A3; SheetNumber: 1; SheetTotal: 4
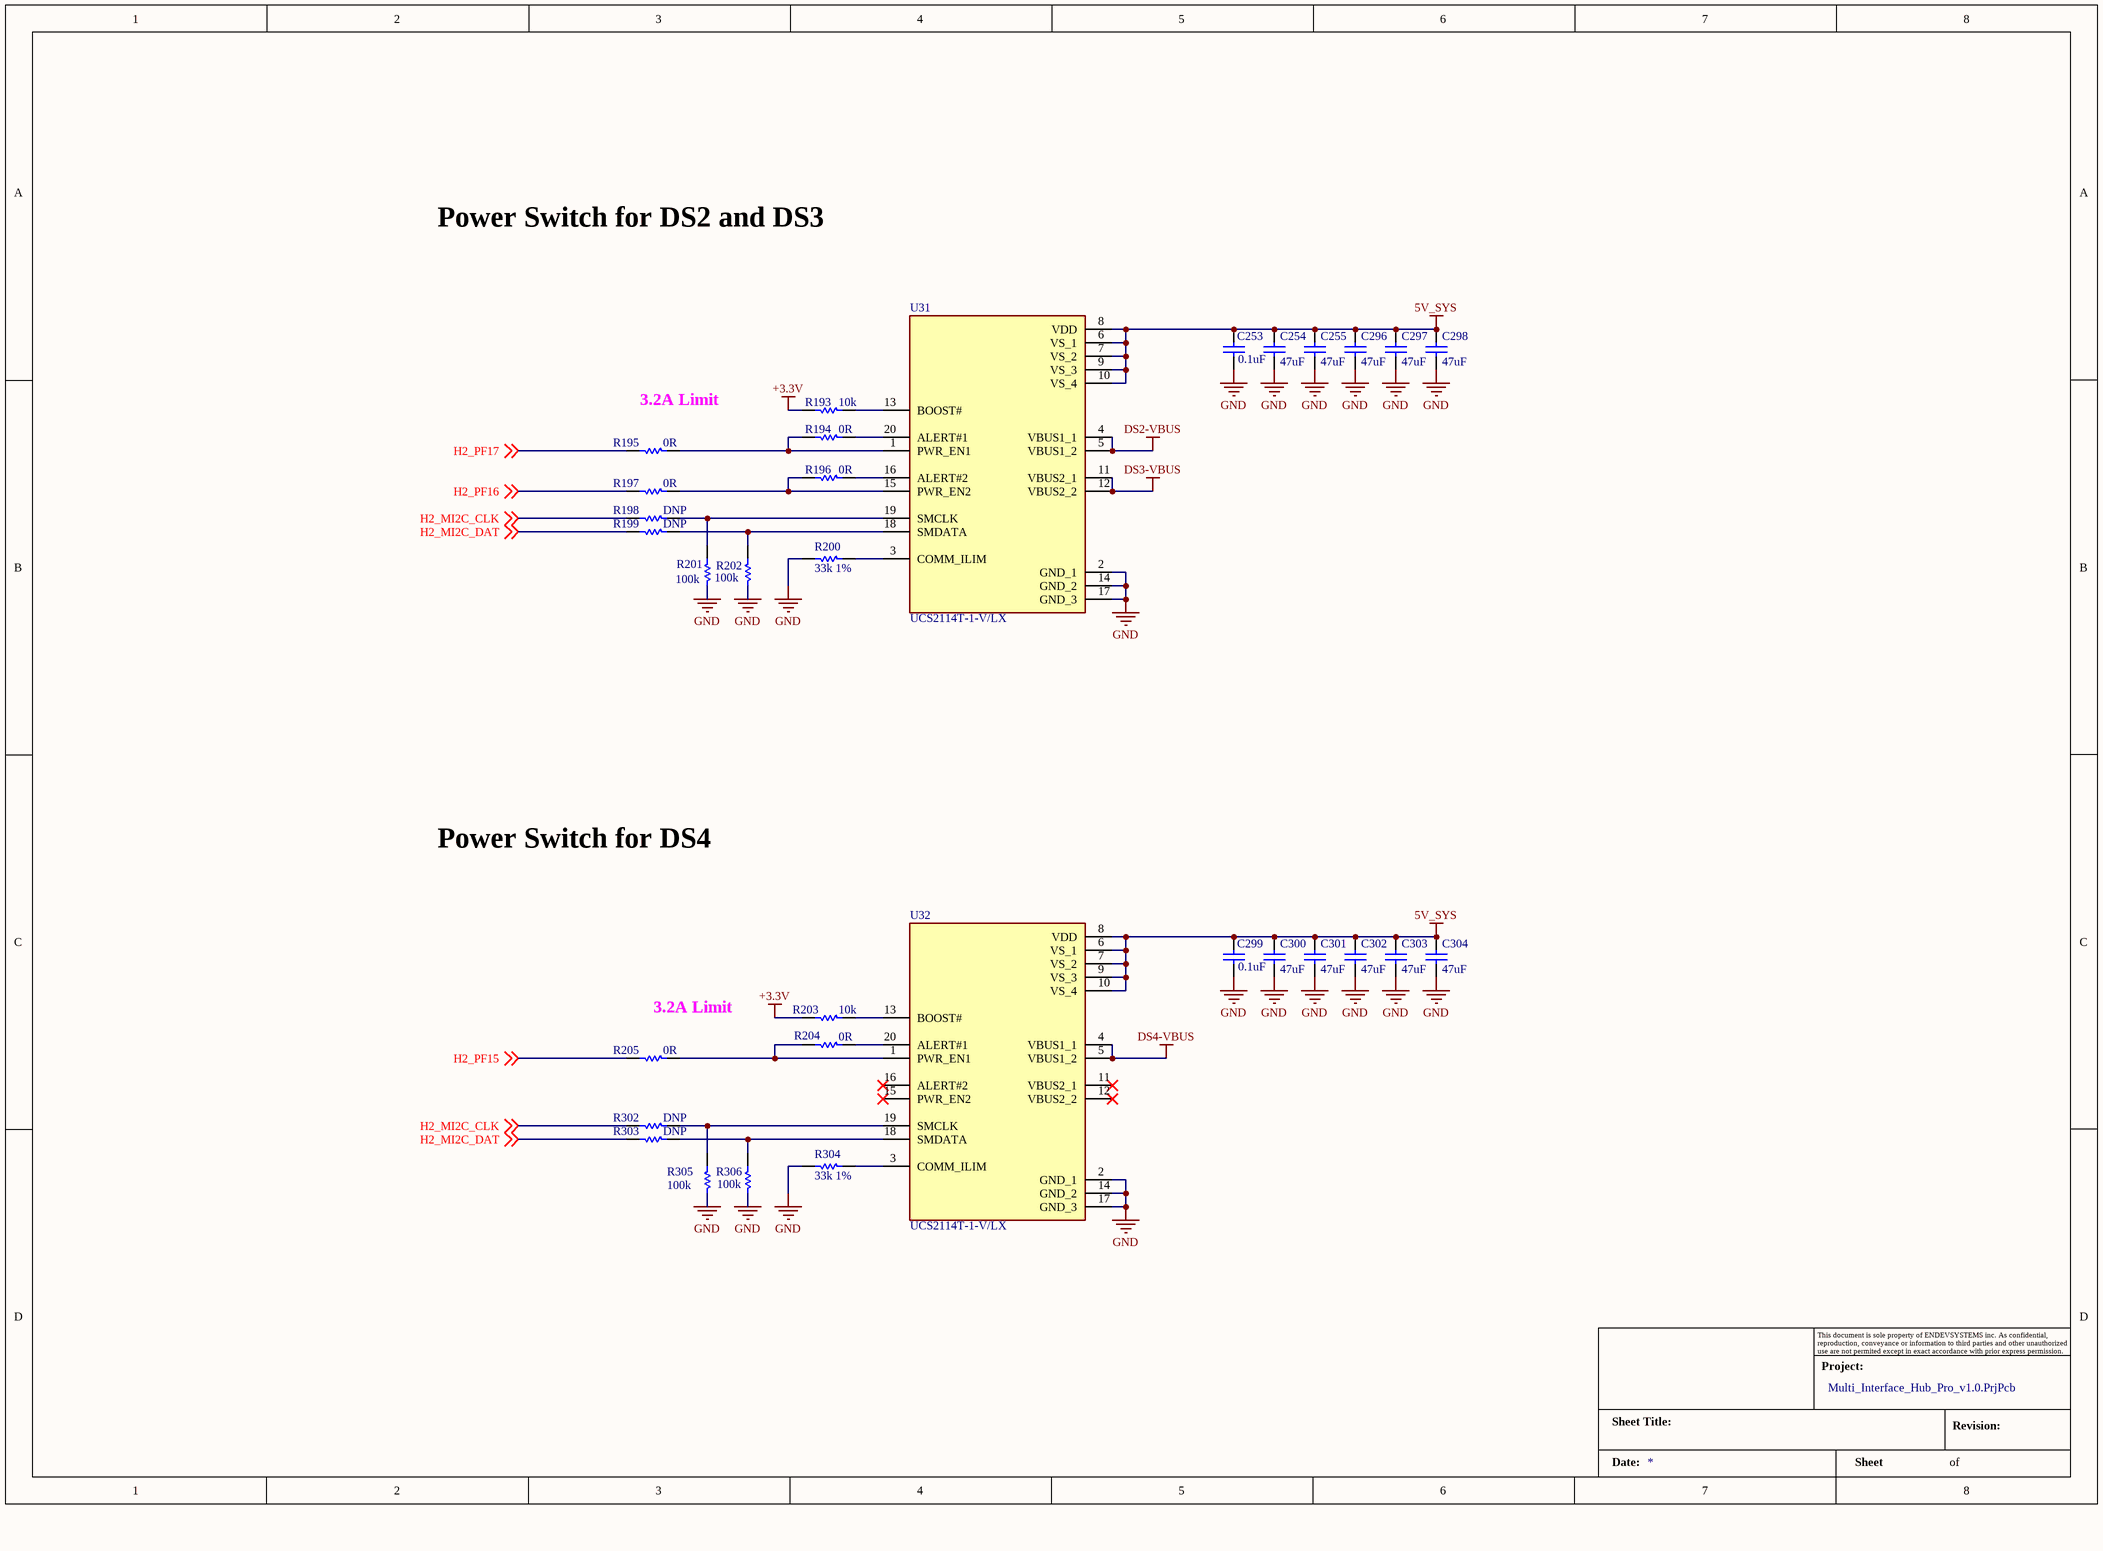
[diagram p9: PowerSwitch_DS2_DS3_DS4.SchDoc]

### Parts
(Parts that share a designator on the sheet are numbered #1, #2 ... from top to bottom, then left to right.)
?#10  Project:: Multi_Interface_Hub_Pro_v1.0.PrjPcb  (hidden comment: Title_Block)  (graphical)
C253  0.1uF  [C-0402/1005]
C254  value 47uF  [C-0402/1005]  (hidden comment: 0.1uF)
C255  value 47uF  [C-0402/1005]  (hidden comment: 0.1uF)
C296  value 47uF  [C-0402/1005]  (hidden comment: 0.1uF)
C297  value 47uF  [C-0402/1005]  (hidden comment: 0.1uF)
C298  value 47uF  [C-0402/1005]  (hidden comment: 0.1uF)
C299  0.1uF  [C-0402/1005]
C300  value 47uF  [C-0402/1005]  (hidden comment: 0.1uF)
C301  value 47uF  [C-0402/1005]  (hidden comment: 0.1uF)
C302  value 47uF  [C-0402/1005]  (hidden comment: 0.1uF)
C303  value 47uF  [C-0402/1005]  (hidden comment: 0.1uF)
C304  value 47uF  [C-0402/1005]  (hidden comment: 0.1uF)
R193  10k  [R-0402/1005]
R194  0R  [R-0402/1005]
R195  0R  [R-0402/1005]
R196  0R  [R-0402/1005]
R197  0R  [R-0402/1005]
R198  DNP  [R-0402/1005]
R199  DNP  [R-0402/1005]
R200  33k 1%  [R-0402/1005]
R201  100k  [R-0402/1005]
R202  100k  [R-0402/1005]
R203  10k  [R-0402/1005]
R204  0R  [R-0402/1005]
R205  0R  [R-0402/1005]
R302  DNP  [R-0402/1005]
R303  DNP  [R-0402/1005]
R304  33k 1%  [R-0402/1005]
R305  100k  [R-0402/1005]
R306  100k  [R-0402/1005]
U31  UCS2114T-1-V/LX  [QFN50P300X300X90-20N-D]
U32  UCS2114T-1-V/LX  [QFN50P300X300X90-20N-D]

### Nets
5V_SYS: C253.2 C254.2 C255.2 C296.2 C297.2 C298.2 C299.2 C300.2 C301.2 C302.2 C303.2 C304.2 U31.6(VS_1) U31.7(VS_2) U31.8(VDD) U31.9(VS_3) U31.10(VS_4) U32.6(VS_1) U32.7(VS_2) U32.8(VDD) U32.9(VS_3) U32.10(VS_4)
+3.3V: R193.1 R203.1
DS2-VBUS: U31.4(VBUS1_1) U31.5(VBUS1_2)
DS3-VBUS: U31.11(VBUS2_1) U31.12(VBUS2_2)
DS4-VBUS: U32.4(VBUS1_1) U32.5(VBUS1_2)
GND: C253.1 C254.1 C255.1 C296.1 C297.1 C298.1 C299.1 C300.1 C301.1 C302.1 C303.1 C304.1 R200.1 R201.1 R202.1 R304.1 R305.1 R306.1 U31.2(GND_1) U31.14(GND_2) U31.17(GND_3) U32.2(GND_1) U32.14(GND_2) U32.17(GND_3)
H2_MI2C_CLK: R198.1 R302.1 ; off-sheet H2_MI2C_CLK
H2_MI2C_DAT: R199.1 R303.1 ; off-sheet H2_MI2C_DAT
H2_PF15: R205.1 ; off-sheet H2_PF15
H2_PF16: R197.1 ; off-sheet H2_PF16
H2_PF17: R195.1 ; off-sheet H2_PF17
NetR193_2: R193.2 U31.13(BOOST#)
NetR194_1: R194.1 R195.2 U31.1(PWR_EN1)
NetR194_2: R194.2 U31.20(ALERT#1)
NetR196_1: R196.1 R197.2 U31.15(PWR_EN2)
NetR196_2: R196.2 U31.16(ALERT#2)
NetR198_2: R198.2 R201.2 U31.19(SMCLK)
NetR199_2: R199.2 R202.2 U31.18(SMDATA)
NetR200_2: R200.2 U31.3(COMM_ILIM)
NetR203_2: R203.2 U32.13(BOOST#)
NetR204_1: R204.1 R205.2 U32.1(PWR_EN1)
NetR204_2: R204.2 U32.20(ALERT#1)
NetR302_2: R302.2 R305.2 U32.19(SMCLK)
NetR303_2: R303.2 R306.2 U32.18(SMDATA)
NetR304_2: R304.2 U32.3(COMM_ILIM)

Not connected (* = marked no-connect by the designer): U32 11(VBUS2_1)* 12(VBUS2_2)* 15(PWR_EN2)* 16(ALERT#2)*

### Notes on the sheet
- Power Switch for DS2 and DS3
- (near R195) 3.2A Limit
- Power Switch for DS4
- (near R205) 3.2A Limit
- (in symbol Title_Block) This document is sole property of ENDEVSYSTEMS inc. As confidential, reproduction, conveyance or information to third parties and other unauthorized use are not permited except in exact accordance with prior express permission.; Project:; Sheet Title:; Revision:; Date:; Sheet; of

### Library data of the parts
C253-C255 C296-C304 = Cap: Capacitor; Published: 8-Jun-2000; LatestRevisionDate: 17-Jul-2002; LatestRevisionNote: Re-released for DXP Platform.; PackageReference: RAD-0.3; Publisher: Altium Limited; PackageDescription: Radial Cap, Thru-Hole; 2 Leads; 0.3 in Pin Spacing
  C253 C299: Value: 0.1uF
R193 R203 = Res1: Resistor; Published: 8-Jun-2000; LatestRevisionDate: 17-Jul-2002; LatestRevisionNote: Re-released for DXP Platform.; PackageReference: AXIAL-0.3; Publisher: Altium Limited; PackageDescription: Axial Device, Thru-Hole; 2 Leads; 0.3 in Pin Spacing; Value: 10K
R194-R202 R204 R205 R302-R306 = Res1: Resistor; Value: 10K; Published: 8-Jun-2000; LatestRevisionDate: 17-Jul-2002; LatestRevisionNote: Re-released for DXP Platform.; PackageReference: AXIAL-0.3; Publisher: Altium Limited; PackageDescription: Axial Device, Thru-Hole; 2 Leads; 0.3 in Pin Spacing
U31 U32 = UCS2114T-1-V_LX: Integrated Circuit; Manufacturer_Name: Microchip; Datasheet Link: https://www.mouser.in/datasheet/2/268/UCS2114_Data_Sheet_20005743B-2900672.pdf; Height: 0.9mm; Manufacturer_Part_Number: UCS2114T-1-V/LX; Mouser Part Number: 579-UCS2114T-1-V/LX; Mouser Price/Stock: https://www.mouser.co.uk/ProductDetail/Microchip-Technology/UCS2114T-1-V-LX?qs=Mv7BduZupUg9QQFwmxWMcA%3D%3D; Arrow Part Number: UCS2114T-1-V/LX; Arrow Price/Stock: https://www.arrow.com/en/products/ucs2114t-1-vlx/microchip-technology?region=nac
?#10 = Title_Block: Date:: *